# Altium project SD171-6.PrjPCB
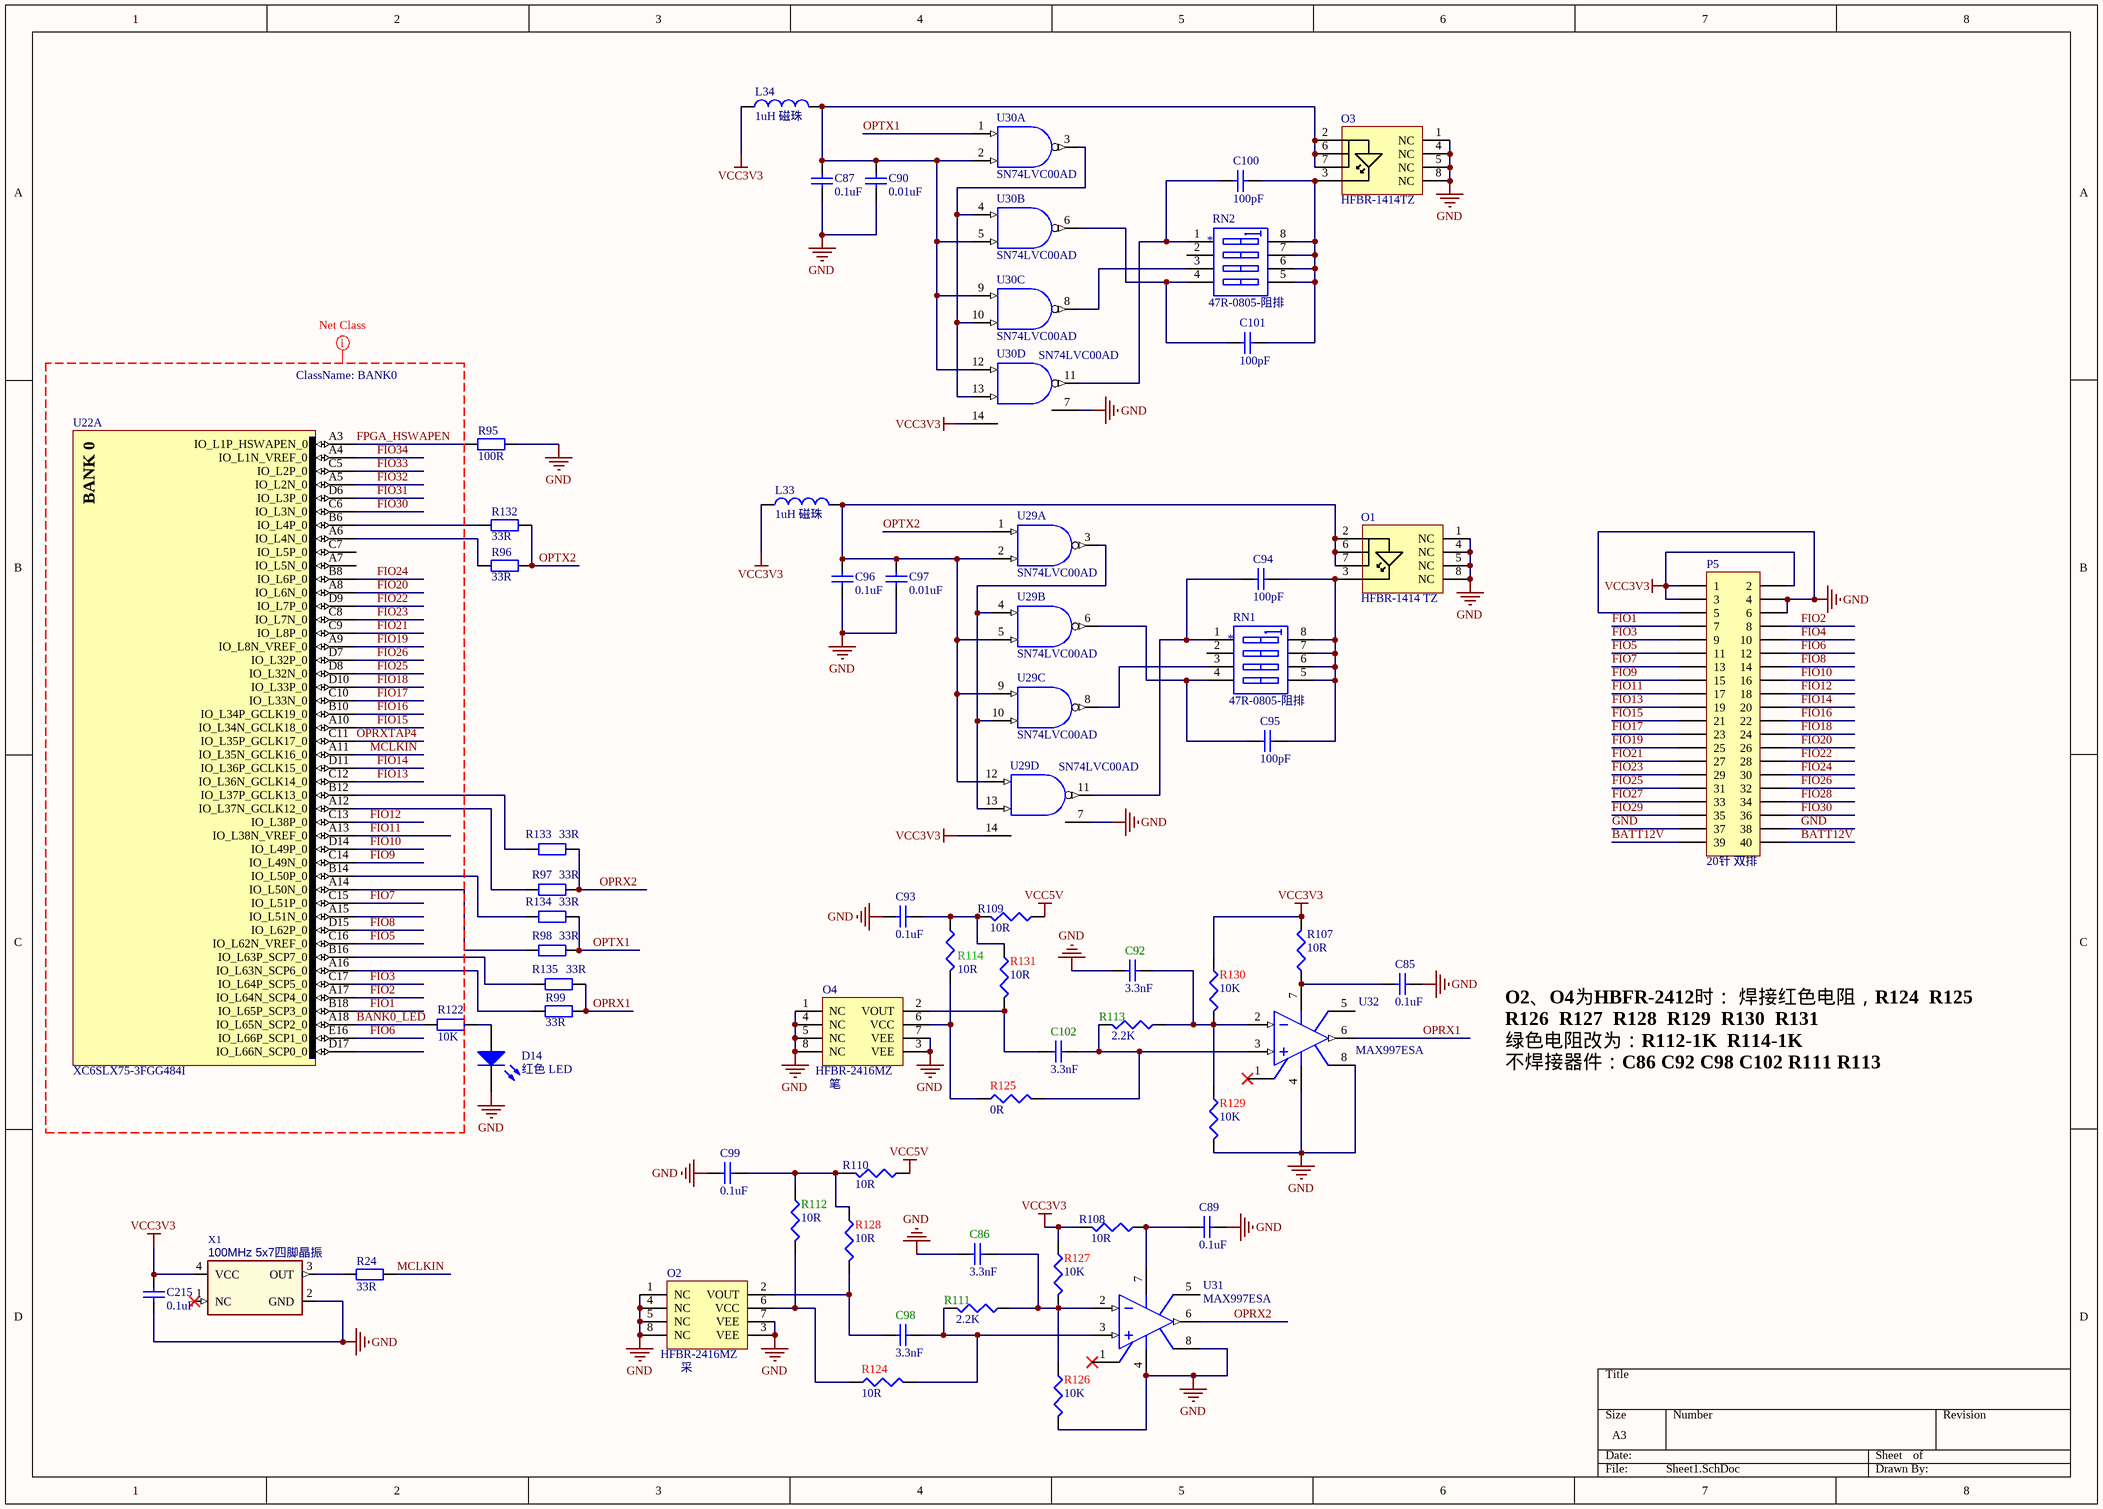
[diagram p0: Sheet1.SchDoc]
4 sheets, 276 parts. Net scope: global (net labels, ports and power ports of the same name join across sheets).
Board file: SD171-6.0PCB4.PcbDoc
Sheets:
  Sheet1.SchDoc
  Sheet3.SchDoc
  Sheet4.SchDoc
  Sheet5.SchDoc

## Sheet Sheet1.SchDoc
size A3

### Parts
C85  0.1uF  [0603C]
C86  3.3nF  [0603C]
C87  0.1uF  [0603C]
C89  0.1uF  [0603C]
C90  0.01uF  [0603C]
C92  3.3nF  [0603C]
C93  0.1uF  [0603C]
C94  100pF  [0603C]
C95  100pF  [0603C]
C96  0.1uF  [0603C]
C97  0.01uF  [0603C]
C98  3.3nF  [0603C]
C99  0.1uF  [0603C]
C100  100pF  [0603C]
C101  100pF  [0603C]
C102  3.3nF  [0603C]
C215  0.1uF  [0603C]
D14  红色 LED  [0805LED]
L33  1uH 磁珠  [1206L]
L34  1uH 磁珠  [1206L]
O1  HFBR-1414 TZ  [OPT]
O2  HFBR-2416MZ  [OPT]
O3  HFBR-1414TZ  [OPT]
O4  HFBR-2416MZ  [OPT]
P5  20针 双排  [HEAD2V40]
R24  33R  [0603R]
R95  100R  [0603R]
R96  33R  [0603R]
R97  33R  [0603R]
R98  33R  [0603R]
R99  33R  [0603R]
R107  10R  [0603R]
R108  10R  [0603R]
R109  10R  [0603R]
R110  10R  [0603R]
R111  2.2K  [0603R]
R112  10R  [0603R]
R113  2.2K  [0603R]
R114  10R  [0603R]
R122  10K  [0603R]
R124  10R  [0603R]
R125  0R  [0603R]
R126  10K  [0603R]
R127  10K  [0603R]
R128  10R  [0603R]
R129  10K  [0603R]
R130  10K  [0603R]
R131  10R  [0603R]
R132  33R  [0603R]
R133  33R  [0603R]
R134  33R  [0603R]
R135  33R  [0603R]
RN1  *  [RNS001]
RN2  *  [RNS001]
U22  XC6SLX75-3FGG484I  [FGG484]  (part A of 8)
U29  SN74LVC00AD  [SMD14X]  (parts A,B,C,D of 4)
U30  SN74LVC00AD  [SMD14X]  (parts A,B,C,D of 4)
U31  MAX997ESA  [SMD8XX]
U32  MAX997ESA  [SMD8XX]
X1  100MHz 5x7四脚晶振  [XTALSMD]

### Nets
BATT12V: P5.39 P5.40
GND: C85.2 C86.2 C87.2 C89.2 C90.1 C92.2 C93.2 C96.2 C97.1 C99.2 C215.2 D14.2(K) O1.1(NC) O1.4(NC) O1.5(NC) O1.8(NC) O2.1(NC) O2.3(VEE) O2.4(NC) O2.5(NC) O2.7(VEE) O2.8(NC) O3.1(NC) O3.4(NC) O3.5(NC) O3.8(NC) O4.1(NC) O4.3(VEE) O4.4(NC) O4.5(NC) O4.7(VEE) O4.8(NC) P5.4 P5.5 P5.6 P5.37 P5.38 R95.1 R126.2 R129.2 U29.7(GND) U30.7(GND) U31.4(V-) U31.8(EXT_CLKB) U32.4(V-) U32.8(EXT_CLKB) X1.2(GND)
VCC: U29.14(VCC) U30.14(VCC)
VCC3V3: C215.1 L33.1 L34.1 P5.1 P5.2 P5.3 R107.2 R108.2 R127.1 R130.1 U29.14(VCC) U30.14(VCC) X1.4(VCC)
VCC5V: R109.1 R110.1
BANK0_LED: R122.1 U22.A18(IO_L65N_SCP2_0)
FIO1: P5.7 U22.B18(IO_L65P_SCP3_0)
FIO2: P5.8 U22.A17(IO_L64N_SCP4_0)
FIO3: P5.9 U22.C17(IO_L64P_SCP5_0)
FIO4: P5.10
FIO5: P5.11 U22.C16(IO_L62N_VREF_0)
FIO6: P5.12 U22.E16(IO_L66P_SCP1_0)
FIO7: P5.13 U22.C15(IO_L51P_0)
FIO8: P5.14 U22.D15(IO_L62P_0)
FIO9: P5.15 U22.C14(IO_L49N_0)
FIO10: P5.16 U22.D14(IO_L49P_0)
FIO11: P5.17 U22.A13(IO_L38N_VREF_0)
FIO12: P5.18 U22.C13(IO_L38P_0)
FIO13: P5.19 U22.C12(IO_L36N_GCLK14_0)
FIO14: P5.20 U22.D11(IO_L36P_GCLK15_0)
FIO15: P5.21 U22.A10(IO_L34N_GCLK18_0)
FIO16: P5.22 U22.B10(IO_L34P_GCLK19_0)
FIO17: P5.23 U22.C10(IO_L33N_0)
FIO18: P5.24 U22.D10(IO_L33P_0)
FIO19: P5.25 U22.A9(IO_L8N_VREF_0)
FIO20: P5.26 U22.A8(IO_L6N_0)
FIO21: P5.27 U22.C9(IO_L8P_0)
FIO22: P5.28 U22.D9(IO_L7P_0)
FIO23: P5.29 U22.C8(IO_L7N_0)
FIO24: P5.30 U22.B8(IO_L6P_0)
FIO25: P5.31 U22.D8(IO_L32N_0)
FIO26: P5.32 U22.D7(IO_L32P_0)
FIO27: P5.33
FIO28: P5.34
FIO29: P5.35
FIO30: P5.36 U22.C6(IO_L3N_0)
FIO31: U22.D6(IO_L3P_0)
FIO32: U22.A5(IO_L2N_0)
FIO33: U22.C5(IO_L2P_0)
FIO34: U22.A4(IO_L1N_VREF_0)
FPGA_HSWAPEN: R95.2 U22.A3(IO_L1P_HSWAPEN_0)
MCLKIN: R24.2 U22.A11(IO_L35N_GCLK16_0)
OPRX1: R99.1 R135.1 U32.6(OUT)
OPRX2: R97.1 R133.1 U31.6(OUT)
OPRXTAP4: U22.C11(IO_L35P_GCLK17_0)
OPTX1: R98.1 R134.1 U30.1(A)
OPTX2: R96.1 R132.1 U29.1(A)
NetC85_1: C85.1 R107.1 U32.7(V+)
NetC86_1: C86.1 R111.1 R126.1 R127.2 U31.2(IN-)
NetC87_1: C87.1 C90.2 L34.2 O3.2 O3.6 O3.7 U30.2(B) U30.5(B) U30.9(A) U30.12(A)
NetC89_1: C89.1 R108.1 U31.7(V+)
NetC92_1: C92.1 R113.1 R129.1 R130.2 U32.2(IN-)
NetC93_1: C93.1 R109.2 R114.1 R131.1
NetC94_1: C94.1 C95.1 O1.3 RN1.5(B4) RN1.6(B3) RN1.7(B2) RN1.8(B1)
NetC94_2: C94.2 RN1.1(A1) U29.11(Y)
NetC95_2: C95.2 RN1.4(A4) U29.6(Y)
NetC96_1: C96.1 C97.2 L33.2 O1.2 O1.6 O1.7 U29.2(B) U29.5(B) U29.9(A) U29.12(A)
NetC98_1: C98.1 R111.2 R124.2 U31.3(IN+)
NetC98_2: C98.2 O2.2(VOUT) R128.2
NetC99_1: C99.1 R110.2 R112.1 R128.1
NetC100_1: C100.1 C101.1 O3.3 RN2.5(B4) RN2.6(B3) RN2.7(B2) RN2.8(B1)
NetC100_2: C100.2 RN2.1(A1) U30.11(Y)
NetC101_2: C101.2 RN2.4(A4) U30.6(Y)
NetC102_1: C102.1 R113.2 R125.2 U32.3(IN+)
NetC102_2: C102.2 O4.2(VOUT) R131.2
NetD14_1: D14.1(A) R122.2
NetO2_6: O2.6(VCC) R112.2 R124.1
NetO4_6: O4.6(VCC) R114.2 R125.1
NetR24_1: R24.1 X1.3(OUT)
NetR96_2: R96.2 U22.A6(IO_L4N_0)
NetR97_2: R97.2 U22.A12(IO_L37N_GCLK12_0)
NetR98_2: R98.2 U22.A14(IO_L50N_0)
NetR99_2: R99.2 U22.A16(IO_L63N_SCP6_0)
NetR132_2: R132.2 U22.B6(IO_L4P_0)
NetR133_2: R133.2 U22.B12(IO_L37P_GCLK13_0)
NetR134_2: R134.2 U22.B14(IO_L50P_0)
NetR135_2: R135.2 U22.B16(IO_L63P_SCP7_0)
NetRN1_3: RN1.3(A3) U29.8(Y)
NetRN2_3: RN2.3(A3) U30.8(Y)
NetU29_3: U29.3(Y) U29.4(A) U29.10(B) U29.13(B)
NetU30_3: U30.3(Y) U30.4(A) U30.10(B) U30.13(B)

Not connected (* = marked no-connect by the designer): RN1 2(A2); RN2 2(A2); U22 A7(IO_L5N_0) A15(IO_L51N_0) C7(IO_L5P_0) D17(IO_L66N_SCP0_0); U31 1(EXT_CLKA)* 5(RTN_CLK); U32 1(EXT_CLKA)* 5(RTN_CLK); X1 1(NC)*

### Layout directives
net class BANK0: BANK0_LED, FIO1, FIO2, FIO3, FIO5, FIO6, FIO7, FIO8, FIO9, FIO10, FIO11, FIO12, FIO13, FIO14, FIO15, FIO16, FIO17, FIO18, FIO19, FIO20, FIO21, FIO22, FIO23, FIO24, FIO25, FIO26, FIO30, FIO31, FIO32, FIO33, FIO34, FPGA_HSWAPEN, MCLKIN, OPRXTAP4

### Notes on the sheet
- (near O4) 笔
- O2、O4为HBFR-2412时： 焊接红色电阻，R124  R125  R126  R127  R128  R129  R130  R131
  绿色电阻改为：R112-1K  R114-1K
  不焊接器件：C86 C92 C98 C102 R111 R113
- (near O2) 采
- (in symbol SW DIP-4) 47R-0805-阻排
- (in symbol XC6SLX45-L1FGG484I, part A) BANK 0

### Library data of the parts
C85 C89 C215 = Cap: Capacitor; Published: 8-Jun-2000; LatestRevisionDate: 17-Jul-2002; LatestRevisionNote: Re-released for DXP Platform.; PackageReference: RAD-0.3; Publisher: Altium Limited; Value: 0.1uF
C86 C92 C93 C98 C99 C102 = Cap: Capacitor; Value: ?pF; Published: 8-Jun-2000; LatestRevisionDate: 17-Jul-2002; LatestRevisionNote: Re-released for DXP Platform.; PackageReference: RAD-0.3; Publisher: Altium Limited
C87 C90 C96 C97 = Cap Semi: Capacitor (Semiconductor SIM Model); Value: ?pF; Published: 8-Jun-2000; LatestRevisionDate: 29-May-2009; LatestRevisionNote: IPC-7351 Footprint Added.; PackageReference: C1206; Publisher: Altium Limited; PackageDescription: Chip Capacitor
C94 C95 C100 C101 = Cap Semi: Capacitor (Semiconductor SIM Model); Value: ?uF; Published: 8-Jun-2000; LatestRevisionDate: 29-May-2009; LatestRevisionNote: IPC-7351 Footprint Added.; PackageReference: C1206; Publisher: Altium Limited; PackageDescription: Chip Capacitor
D14 = LED0: Typical INFRARED GaAs LED; Published: 8-Jun-2000; LatestRevisionDate: 08-Jul-2005; LatestRevisionNote: Mech Layer 1 removed.; PackageReference: LED-0; Publisher: Altium Limited
L33 L34 = Inductor: Code_IEC: 1005; Published: 8-Jun-2000; LatestRevisionDate: 29-May-2009; LatestRevisionNote: IPC-7351 Footprint Added.; PackageReference: 0402-A; Publisher: Altium Limited; PackageDescription: Chip Inductor; Code_JEITA: 0402
O1 O3 = HFBR-1414
O2 O4 = OPTO
P5 = MHDR2X20: Header, 20-Pin, Dual row; LatestRevisionDate: 17-Jul-2002; LatestRevisionNote: Re-released for DXP Platform.; Publisher: Altium Limited
R24 R95-R99 R122 R132-R135 = Res2: Resistor; Published: 8-Jun-2000; LatestRevisionDate: 17-Jul-2002; LatestRevisionNote: Re-released for DXP Platform.; PackageReference: AXIAL-0.4; Publisher: Altium Limited
  R24 R96-R99 R132-R135: Value: 33R
  R95: Value: 100R
  R122: Value: 10K
R107-R114 R124 R128 R131 = Res3: Resistor; Published: 8-Jun-2000; LatestRevisionDate: 29-May-2009; LatestRevisionNote: IPC-7351 Footprint Added.; PackageReference: J1-0603; Publisher: Altium Limited; PackageDescription: Chip Resistor
  R107-R110 R112 R114 R124 R128 R131: Value: 10R
  R111 R113: Value: 2.2K
R125-R127 R129 R130 = Res3: Resistor; Value: 10R; Published: 8-Jun-2000; LatestRevisionDate: 29-May-2009; LatestRevisionNote: IPC-7351 Footprint Added.; PackageReference: J1-0603; Publisher: Altium Limited; PackageDescription: Chip Resistor
RN1 RN2 = SW DIP-4: DIP Switch, 4 Position, SPST; Published: 24-Mar-1999; LatestRevisionDate: 29-May-2009; LatestRevisionNote: IPC-7351 Footprint Added.; PackageVersion: Dec-2002; PackageReference: SO8; Publisher: Altium Limited; PackageDescription: 8-Pin Small Outline Integrated Circuit 1.27 mm Pitch; Code_JEDEC: MS-012-AA; Code_IPC: SOIC127P600-8
U22 = XC6SLX45-L1FGG484I: Spartan-6 LX 1.0V FPGA, 316 User I/Os, 484-Ball Fine-Pitch BGA (1.0mm Pitch), Low Power Version, Industrial Grade, Pb-Free; FirstPublished: 17-Nov-2009; DatasheetVersion: ver1.3, Nov-2009; PackageVersion: ver1.1, Dec-2008; PackageReference: FGG484; Publisher: Altium Limited; PackageDescription: 484-Ball Fine Pitch Ball Grid Array 1.00 mm Pitch (FGG484) - Pb-Free; Code_JEDEC: MS-034-AAJ-1; Code_IPC: BGA100P22X22-484; ComponentLink1Description: Spartan-6 Datasheet; ComponentLink1URL: http://www.xilinx.com/support/documentation/data_sheets/ds160.pdf; ComponentLink2Description: Pinout Specification; ComponentLink2URL: http://www.xilinx.com/support/documentation/user_guides/ug385.pdf; ComponentLink3Description: FGG484 Package Drawing; ComponentLink3URL: http://www.xilinx.com/support/documentation/package_specs/fg484.pdf; ComponentLink4Description: Spartan-6 Documents; ComponentLink4URL: http://www.xilinx.com/support/documentation/spartan-6.htm; ComponentLink5Description: Xilinx.com Home; ComponentLink5URL: http://www.xilinx.com
U29 U30 = SN74LVC00AD: Quadruple 2-Input Positive-NAND Gate; Published: 8-Jun-2000; LatestRevisionDate: 13-Apr-2006; LatestRevisionNote: IPC-7351 Footprint Added.; DatasheetVersion: Jun-1998; PackageVersion: Jan-1998; PackageReference: D014; Publisher: Altium Limited; PackageDescription: 14-Pin Small Outline Integrated Circuit 1.27 mm Pitch; Code_IPC: SOIC127P600-14; ComponentLink1Description: Manufacturer Link; ComponentLink1URL: http://www.ti.com/; ComponentLink2Description: Datasheet; ComponentLink2URL: http://www-s.ti.com/sc/ds/SN54LVC00A.pdf
U31 U32 = ICL7650BCSA-1: Chopper Stabilized Operational Amplifier; Published: 16-Jan-2001; LatestRevisionDate: 13-Apr-2006; LatestRevisionNote: IPC-7351 Footprint Added.; DatasheetVersion: Aug-1996; PackageReference: NSO8; Publisher: Altium Limited; PackageDescription: 8-Pin Small Outline Integrated Circuit 1.27 mm Pitch; Code_JEDEC: MS-012-AA; Code_IPC: SOIC127P600-8; ComponentLink1Description: Manufacturer Link; ComponentLink1URL: http://www.maxim-ic.com/; ComponentLink2Description: Datasheet; ComponentLink2URL: http://pdfserv.maxim-ic.com/en/ds/ICL7650-ICL7650B.pdf
X1 = TCXO 20MHz Rakon E5249LF 5x3.2: TCXO, 20MHz, 100ppb, 5x3.2mm SMT, clipped sine o/p; Alternative Parts/Notes: E5074LF; Manufacturer: Rakon; ALS Lib: L3078B; Tolerance: 50ppm; Notes: aka  E5074LF (Ubiquisys-specific part no); CLASS: IC; Volts: 3.3V; Full Part No: E5249LF; Case: 5 x 3.2mm

## Sheet Sheet3.SchDoc
size A3
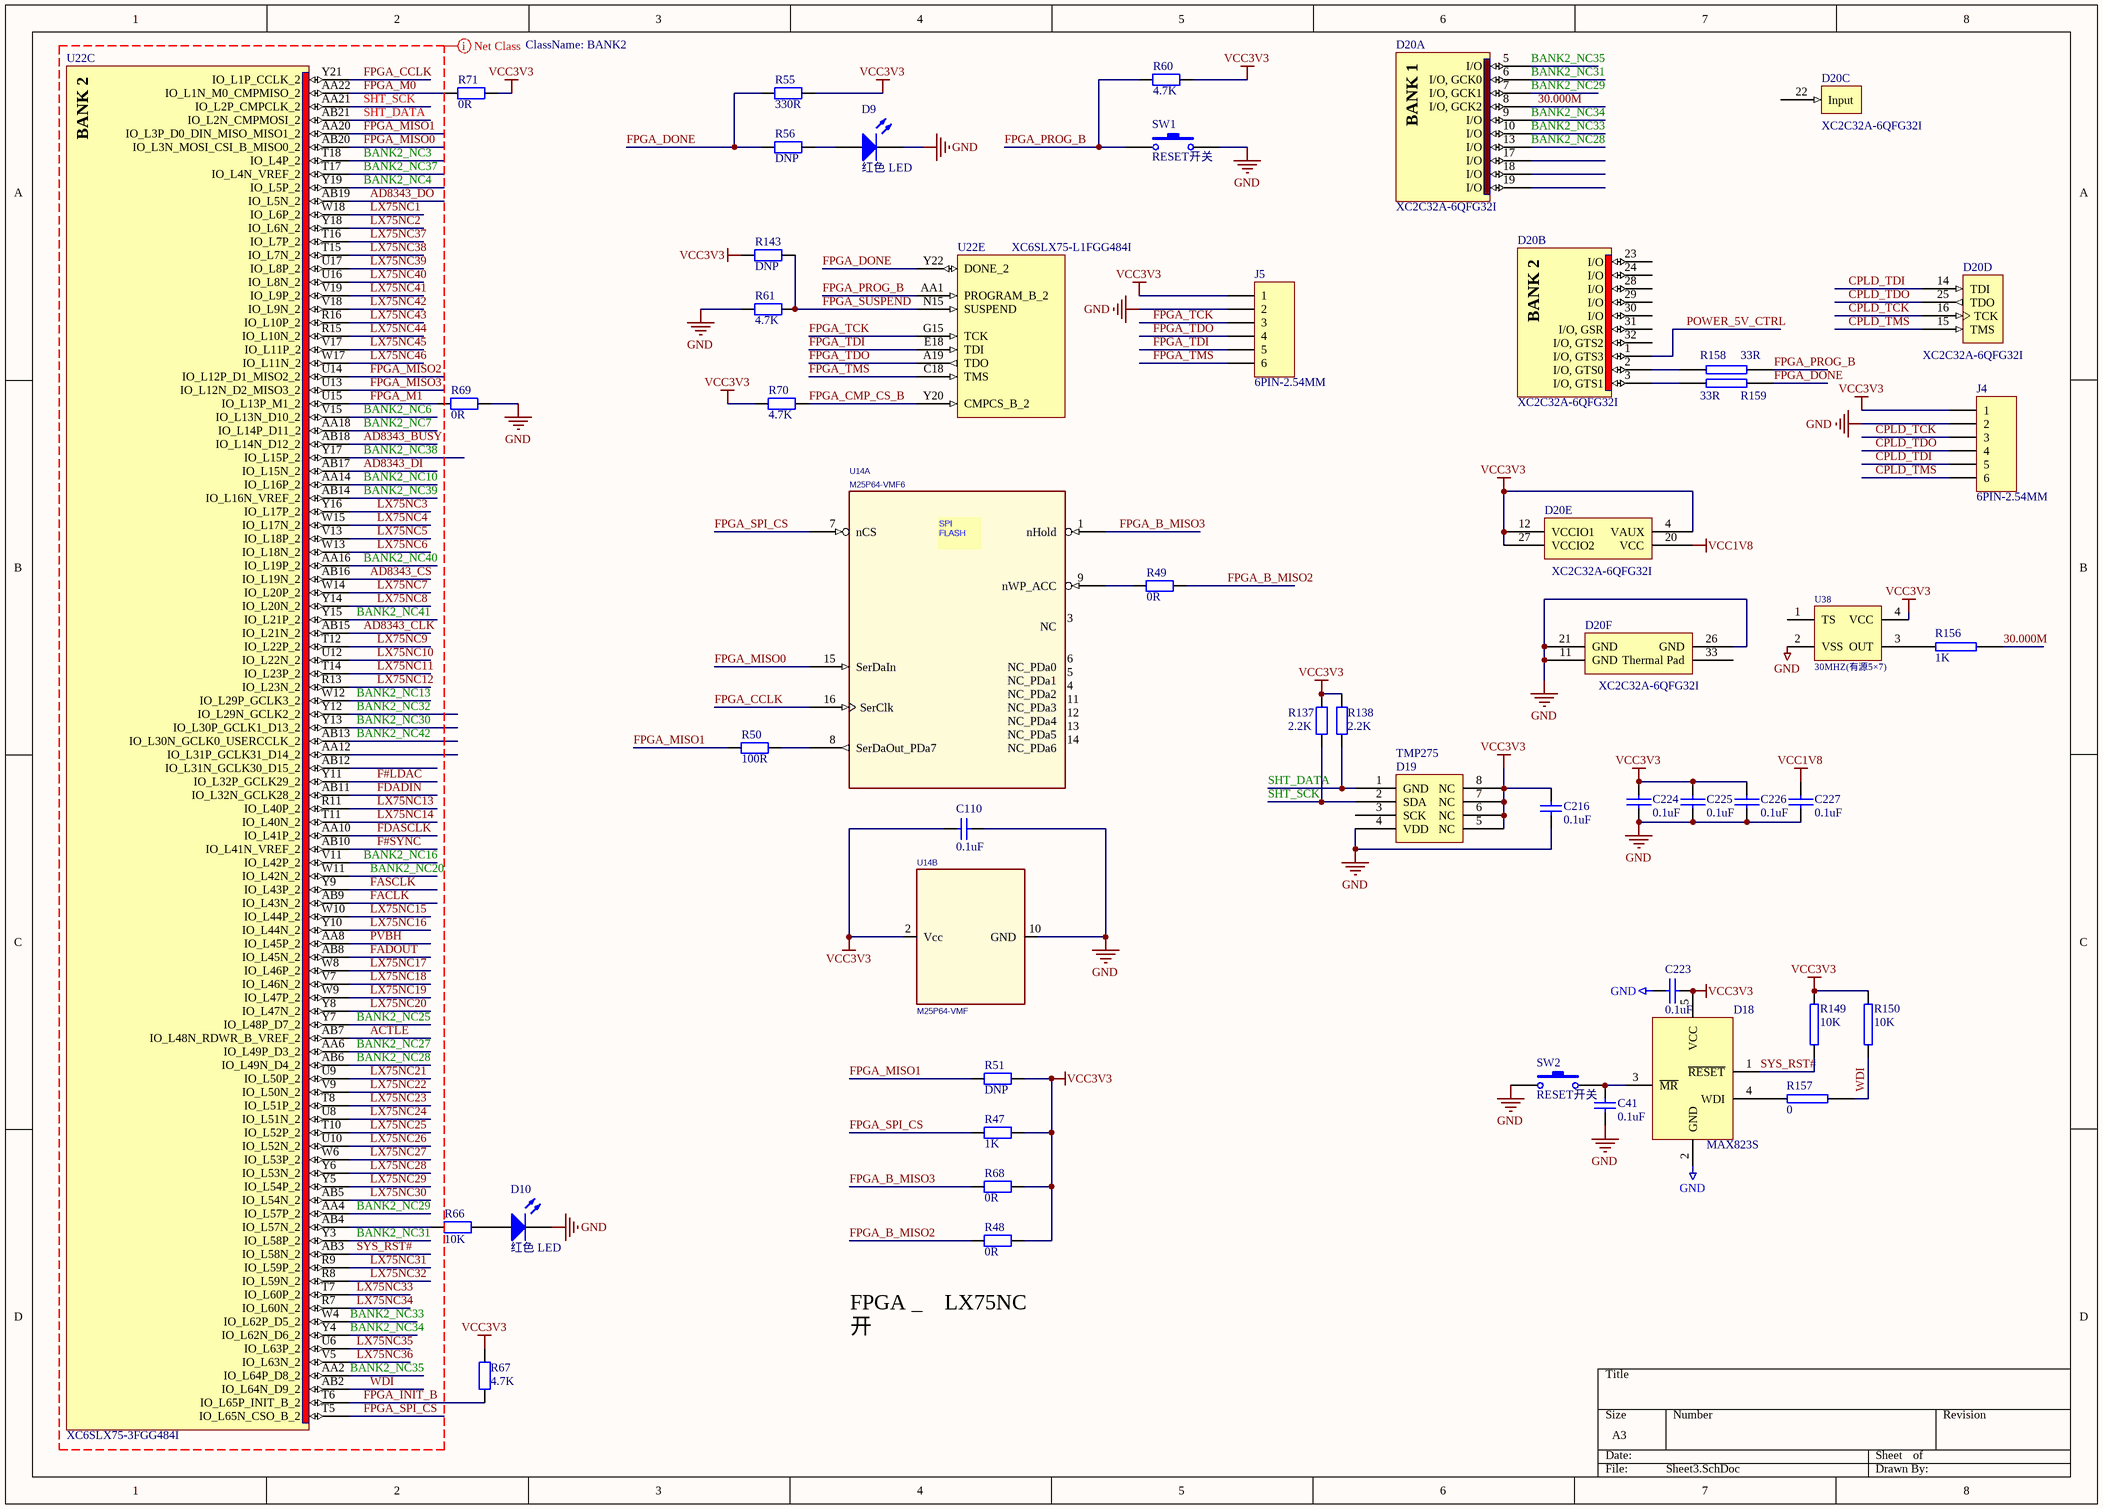
[diagram p1: Sheet3.SchDoc]

### Parts
C41  0.1uF  [0603C]
C110  0.1uF  [0402C]
C216  0.1uF  [0402C]
C223  0.1uF  [0603X]
C224  0.1uF  [0402C]
C225  0.1uF  [0402C]
C226  0.1uF  [0402C]
C227  0.1uF  [0402C]
D9  红色 LED  [0805LED]
D10  红色 LED  [0805LED]
D18  MAX823S  [MAX823]
D19  TMP275  [SMD8XX]
D20  XC2C32A-6QFG32I  [QFG32_N]  (parts A,B,C,D,E,F of 6)
J4  6PIN-2.54MM  [SIP6X]
J5  6PIN-2.54MM  [SIP6X]
R47  1K  [0603R]
R48  0R  [0603R]
R49  0R  [0603R]
R50  100R  [0603R]
R51  DNP  [0603R]
R55  330R  [0603R]
R56  DNP  [0603R]
R60  4.7K  [0603R]
R61  4.7K  [0603R]
R66  10K  [0603R]
R67  4.7K  [0603R]
R68  0R  [0603R]
R69  0R  [0603R]
R70  4.7K  [0603R]
R71  0R  [0603R]
R137  2.2K  [0603R]
R138  2.2K  [0603R]
R143  DNP  [0603R]
R149  10K  [0603X]
R150  10K  [0603X]
R156  1K  [0603]
R157  0  [0603]
R158  33R  [0603R]
R159  33R  [0603R]
SW1  RESET开关  [RESETKEY]
SW2  RESET开关  [RESETKEY]
U14  M25P64-VMF6  [SOIC16]  (parts A,B of 2)
U22  XC6SLX75-3FGG484I  [FGG484]  (parts C,E of 8)
U38  30MHZ(有源5×7)  [30M]

### Nets
GND: C41.1 C110.1 C216.1 C223.1 C224.1 C225.1 C226.1 C227.1 D9.2(K) D10.2(K) D18.2(GND) D19.4(VDD) D20.11(GND) D20.21(GND) D20.26(GND) J4.2 J5.2 R61.1 R69.1 SW1.2 SW2.1 U14.10(GND) U38.2(VSS)
VCC1V8: C227.2 D20.20(VCC)
VCC3V3: C110.2 C216.2 C223.2 C224.2 C225.2 C226.2 D18.5(VCC) D19.5(NC) D19.6(NC) D19.7(NC) D19.8(NC) D20.4(VAUX) D20.12(VCCIO1) D20.27(VCCIO2) J4.1 J5.1 R47.2 R48.2 R51.2 R55.2 R60.2 R67.1 R68.2 R70.1 R71.1 R137.1 R138.1 R143.1 R149.2 R150.2 U14.2(Vcc) U38.4(VCC)
30.000M: D20.8(I/O,_GCK2) R156.2
ACTLE: U22.AB7(IO_L48N_RDWR_B_VREF_2)
AD8343_BUSY: U22.AB18(IO_L14N_D12_2)
AD8343_CLK: U22.AB15(IO_L21N_2)
AD8343_CS: U22.AB16(IO_L19N_2)
AD8343_DI: U22.AB17(IO_L15N_2)
AD8343_DO: U22.AB19(IO_L5N_2)
BANK2_NC3: U22.T18(IO_L4P_2)
BANK2_NC4: U22.Y19(IO_L5P_2)
BANK2_NC6: U22.V15(IO_L13N_D10_2)
BANK2_NC7: U22.AA18(IO_L14P_D11_2)
BANK2_NC10: U22.AA14(IO_L16P_2)
BANK2_NC13: U22.W12(IO_L29P_GCLK3_2)
BANK2_NC16: U22.V11(IO_L42P_2)
BANK2_NC20: U22.W11(IO_L42N_2)
BANK2_NC25: U22.Y7(IO_L48P_D7_2)
BANK2_NC27: U22.AA6(IO_L49P_D3_2)
BANK2_NC28: D20.13(I/O) U22.AB6(IO_L49N_D4_2)
BANK2_NC29: D20.7(I/O,_GCK1) U22.AA4(IO_L57P_2)
BANK2_NC30: U22.Y13(IO_L30P_GCLK1_D13_2)
BANK2_NC31: D20.6(I/O,_GCK0) U22.Y3(IO_L58P_2)
BANK2_NC32: U22.Y12(IO_L29N_GCLK2_2)
BANK2_NC33: D20.10(I/O) U22.W4(IO_L62P_D5_2)
BANK2_NC34: D20.9(I/O) U22.Y4(IO_L62N_D6_2)
BANK2_NC35: D20.5(I/O) U22.AA2(IO_L64P_D8_2)
BANK2_NC37: U22.T17(IO_L4N_VREF_2)
BANK2_NC38: U22.Y17(IO_L15P_2)
BANK2_NC39: U22.AB14(IO_L16N_VREF_2)
BANK2_NC40: U22.AA16(IO_L19P_2)
BANK2_NC41: U22.Y15(IO_L21P_2)
BANK2_NC42: U22.AB13(IO_L30N_GCLK0_USERCCLK_2)
CPLD_TCK: D20.16(TCK) J4.3
CPLD_TDI: D20.14(TDI) J4.5
CPLD_TDO: D20.25(TDO) J4.4
CPLD_TMS: D20.15(TMS) J4.6
F#LDAC: U22.Y11(IO_L32P_GCLK29_2)
F#SYNC: U22.AB10(IO_L41N_VREF_2)
FACLK: U22.AB9(IO_L43N_2)
FADOUT: U22.AB8(IO_L45N_2)
FASCLK: U22.Y9(IO_L43P_2)
FDADIN: U22.AB11(IO_L32N_GCLK28_2)
FDASCLK: U22.AA10(IO_L41P_2)
FPGA_B_MISO2: R48.1 R49.2
FPGA_B_MISO3: R68.1 U14.1(nHold)
FPGA_CCLK: U14.16(SerClk) U22.Y21(IO_L1P_CCLK_2)
FPGA_CMP_CS_B: R70.2 U22.Y20(CMPCS_B_2)
FPGA_DONE: R55.1 R56.1 R159.2 U22.Y22(DONE_2)
FPGA_INIT_B: R67.2 U22.T6(IO_L65P_INIT_B_2)
FPGA_M0: R71.2 U22.AA22(IO_L1N_M0_CMPMISO_2)
FPGA_M1: R69.2 U22.U15(IO_L13P_M1_2)
FPGA_MISO0: U14.15(SerDaIn) U22.AB20(IO_L3N_MOSI_CSI_B_MISO0_2)
FPGA_MISO1: R50.1 R51.1 U22.AA20(IO_L3P_D0_DIN_MISO_MISO1_2)
FPGA_MISO2: U22.U14(IO_L12P_D1_MISO2_2)
FPGA_MISO3: U22.U13(IO_L12N_D2_MISO3_2)
FPGA_PROG_B: R60.1 R158.2 SW1.1 U22.AA1(PROGRAM_B_2)
FPGA_SPI_CS: R47.1 U14.7(nCS) U22.T5(IO_L65N_CSO_B_2)
FPGA_SUSPEND: R61.2 R143.2 U22.N15(SUSPEND)
FPGA_TCK: J5.3 U22.G15(TCK)
FPGA_TDI: J5.5 U22.E18(TDI)
FPGA_TDO: J5.4 U22.A19(TDO)
FPGA_TMS: J5.6 U22.C18(TMS)
LX75NC1: U22.W18(IO_L6P_2)
LX75NC2: U22.Y18(IO_L6N_2)
LX75NC3: U22.Y16(IO_L17P_2)
LX75NC4: U22.W15(IO_L17N_2)
LX75NC5: U22.V13(IO_L18P_2)
LX75NC6: U22.W13(IO_L18N_2)
LX75NC7: U22.W14(IO_L20P_2)
LX75NC8: U22.Y14(IO_L20N_2)
LX75NC9: U22.T12(IO_L22P_2)
LX75NC10: U22.U12(IO_L22N_2)
LX75NC11: U22.T14(IO_L23P_2)
LX75NC12: U22.R13(IO_L23N_2)
LX75NC13: U22.R11(IO_L40P_2)
LX75NC14: U22.T11(IO_L40N_2)
LX75NC15: U22.W10(IO_L44P_2)
LX75NC16: U22.Y10(IO_L44N_2)
LX75NC17: U22.W8(IO_L46P_2)
LX75NC18: U22.V7(IO_L46N_2)
LX75NC19: U22.W9(IO_L47P_2)
LX75NC20: U22.Y8(IO_L47N_2)
LX75NC21: U22.U9(IO_L50P_2)
LX75NC22: U22.V9(IO_L50N_2)
LX75NC23: U22.T8(IO_L51P_2)
LX75NC24: U22.U8(IO_L51N_2)
LX75NC25: U22.T10(IO_L52P_2)
LX75NC26: U22.U10(IO_L52N_2)
LX75NC27: U22.W6(IO_L53P_2)
LX75NC28: U22.Y6(IO_L53N_2)
LX75NC29: U22.Y5(IO_L54P_2)
LX75NC30: U22.AB5(IO_L54N_2)
LX75NC31: U22.R9(IO_L59P_2)
LX75NC32: U22.R8(IO_L59N_2)
LX75NC33: U22.T7(IO_L60P_2)
LX75NC34: U22.R7(IO_L60N_2)
LX75NC35: U22.U6(IO_L63P_2)
LX75NC36: U22.V5(IO_L63N_2)
LX75NC37: U22.T16(IO_L7P_2)
LX75NC38: U22.T15(IO_L7N_2)
LX75NC39: U22.U17(IO_L8P_2)
LX75NC40: U22.U16(IO_L8N_2)
LX75NC41: U22.V19(IO_L9P_2)
LX75NC42: U22.V18(IO_L9N_2)
LX75NC43: U22.R16(IO_L10P_2)
LX75NC44: U22.R15(IO_L10N_2)
LX75NC45: U22.V17(IO_L11P_2)
LX75NC46: U22.W17(IO_L11N_2)
POWER_5V_CTRL: D20.1(I/O,_GTS3)
PVBH: U22.AA8(IO_L45P_2)
SHT_DATA: D19.1(GND) R138.2 U22.AB21(IO_L2N_CMPMOSI_2)
SHT_SCK: D19.2(SDA) R137.2 U22.AA21(IO_L2P_CMPCLK_2)
SYS_RST#: D18.1(~{RESET}) R149.1 U22.AB3(IO_L58N_2)
WDI: R150.1 R157.2 U22.AB2(IO_L64N_D9_2)
NetC41_2: C41.2 D18.3(~{MR}) SW2.2
NetD9_1: D9.1(A) R56.2
NetD10_1: D10.1(A) R66.2
NetD18_4: D18.4(WDI) R157.1
NetD20_2: D20.2(I/O,_GTS0) R158.1
NetD20_3: D20.3(I/O,_GTS1) R159.1
NetR49_1: R49.1 U14.9(nWP_ACC)
NetR50_2: R50.2 U14.8(SerDaOut_PDa7)
NetR66_1: R66.1 U22.AB4(IO_L57N_2)
NetR156_1: R156.1 U38.3(OUT)

Not connected (* = marked no-connect by the designer): D19 3(SCK); D20 17(I/O) 18(I/O) 19(I/O) 22(Input) 23(I/O) 24(I/O) 28(I/O) 29(I/O) 30(I/O) 31(I/O,_GSR) 32(I/O,_GTS2) 33(Thermal_Pad); U14 3(NC) 4(NC_PDa2) 5(NC_PDa1) 6(NC_PDa0) 11(NC_PDa3) 12(NC_PDa4) 13(NC_PDa5) 14(NC_PDa6); U22 AA12(IO_L31P_GCLK31_D14_2) AB12(IO_L31N_GCLK30_D15_2); U38 1(TS)

### Layout directives
net class BANK2: ACTLE, AD8343_BUSY, AD8343_CLK, AD8343_CS, AD8343_DI, AD8343_DO, BANK2_NC3, BANK2_NC4, BANK2_NC6, BANK2_NC7, BANK2_NC10, BANK2_NC13, BANK2_NC16, BANK2_NC20, BANK2_NC25, BANK2_NC27, BANK2_NC28, BANK2_NC29, BANK2_NC30, BANK2_NC31, BANK2_NC32, BANK2_NC33, BANK2_NC34, BANK2_NC35, BANK2_NC37, BANK2_NC38, BANK2_NC39, BANK2_NC40, BANK2_NC41, BANK2_NC42, F#LDAC, F#SYNC, FACLK, FADOUT, FASCLK, FDADIN, FDASCLK, FPGA_CCLK, FPGA_INIT_B, FPGA_M0, FPGA_M1, FPGA_MISO0, FPGA_MISO1, FPGA_MISO2, FPGA_MISO3, FPGA_SPI_CS, LX75NC1, LX75NC2, LX75NC3, LX75NC4, LX75NC5, LX75NC6, LX75NC7, LX75NC8, LX75NC9, LX75NC10, LX75NC11, LX75NC12, LX75NC13, LX75NC14, LX75NC15, LX75NC16, LX75NC17, LX75NC18, LX75NC19, LX75NC20, LX75NC21, LX75NC22, LX75NC23, LX75NC24, LX75NC25, LX75NC26, LX75NC27, LX75NC28, LX75NC29, LX75NC30, LX75NC31, LX75NC32, LX75NC33, LX75NC34, LX75NC35, LX75NC36, LX75NC37, LX75NC38, LX75NC39, LX75NC40, LX75NC41, LX75NC42, LX75NC43, LX75NC44, LX75NC45, LX75NC46, PVBH, SHT_DATA, SHT_SCK, SYS_RST#, WDI

### Notes on the sheet
- (near R48) FPGA _    LX75NC 开
- (in symbol SPI FLASH 128Mb S25FL128P, part A) SPI / FLASH
- (in symbol XC2C32A-6QFG32C, part A) BANK 1
- (in symbol XC2C32A-6QFG32C, part B) BANK 2
- (in symbol XC6SLX45-L1FGG484I, part C) BANK 2

### Library data of the parts
C41 C110 C216 = Cap: Capacitor; Published: 8-Jun-2000; LatestRevisionDate: 17-Jul-2002; LatestRevisionNote: Re-released for DXP Platform.; PackageReference: RAD-0.3; Publisher: Altium Limited; Value: 0.1uF
C223-C227 = 2543.S01_104_49
D9 = LED2: Typical RED, GREEN, YELLOW, AMBER GaAs LED; Published: 8-Jun-2000; LatestRevisionDate: 17-Jul-2002; LatestRevisionNote: Re-released for DXP Platform.; PackageVersion: Feb-2002; PackageReference: 3.2X1.6X1.1; Publisher: Altium Limited
D10 = LED0: Typical INFRARED GaAs LED; Published: 8-Jun-2000; LatestRevisionDate: 08-Jul-2005; LatestRevisionNote: Mech Layer 1 removed.; PackageReference: LED-0; Publisher: Altium Limited
D18 = MAX823: MAX823复位监控芯片
D19 = SHT11
D20 = XC2C32A-6QFG32C: CoolRunner-II 1.8V, 32 Macrocell CPLD, 21 User I/Os, 32-Pin QFNL, Commercial Grade, Pb-Free; FirstPublished: 8-Jul-2005; LatestRevisionDate: 30-Oct-2009; LatestRevisionNote: Updated to datasheet version 3.1 Sep-2008.; DatasheetVersion: ver2.1, Nov-2008; PackageVersion: ver1.0, Aug-2004; PackageReference: QFG32; Publisher: Altium Limited; PackageDescription: 32-Pin Quad Flat No-Lead (QFG32) - Pb-Free; Supplier 1: Digi-Key; Supplier Part Number 1: 122-1412-ND; Code_JEDEC: MO-220; ComponentLink1Description: XC2C32A Datasheet; ComponentLink1URL: http://www.xilinx.com/support/documentation/data_sheets/ds310.pdf; ComponentLink2Description: QFG32 Package Drawing; ComponentLink2URL: http://www.xilinx.com/support/documentation/package_specs/qfg32.pdf; ComponentLink3Description: CoolRunner-II Documents; ComponentLink3URL: http://www.xilinx.com/support/documentation/coolrunner-ii.htm; ComponentLink4Description: Xilinx.com Home; ComponentLink4URL: http://www.xilinx.com
J4 J5 = Header 6: Header, 6-Pin; LatestRevisionDate: 17-Jul-2002; LatestRevisionNote: Re-released for DXP Platform.; Publisher: Altium Limited
R47 R50 R51 R60 R61 R66 R67 R69 R70 = Res2: Resistor; Published: 8-Jun-2000; LatestRevisionDate: 17-Jul-2002; LatestRevisionNote: Re-released for DXP Platform.; PackageReference: AXIAL-0.4; Publisher: Altium Limited
  R47: Value: 1K
  R50: Value: 100R
  R51: Value: DNP
  R60 R61 R67 R70: Value: 4.7K
  R66: Value: 10K
  R69: Value: 0R
R48 R68 = Res2: Resistor; Value: 1.8K; Published: 8-Jun-2000; LatestRevisionDate: 17-Jul-2002; LatestRevisionNote: Re-released for DXP Platform.; PackageReference: AXIAL-0.4; Publisher: Altium Limited
R49 R137 R138 = Res2: Resistor; Value: 100R; Published: 8-Jun-2000; LatestRevisionDate: 17-Jul-2002; LatestRevisionNote: Re-released for DXP Platform.; PackageReference: AXIAL-0.4; Publisher: Altium Limited
R55 R143 = Res2: Resistor; Value: 4.7K; Published: 8-Jun-2000; LatestRevisionDate: 17-Jul-2002; LatestRevisionNote: Re-released for DXP Platform.; PackageReference: AXIAL-0.4; Publisher: Altium Limited
R56 = Res2: Resistor; Value: 510; Published: 8-Jun-2000; LatestRevisionDate: 17-Jul-2002; LatestRevisionNote: Re-released for DXP Platform.; PackageReference: AXIAL-0.4; Publisher: Altium Limited
R71 = Res2: Resistor; Value: 4K7; Published: 8-Jun-2000; LatestRevisionDate: 17-Jul-2002; LatestRevisionNote: Re-released for DXP Platform.; PackageReference: AXIAL-0.4; Publisher: Altium Limited
R149 R150 = RES2: 电阻
R156-R159 = RES2
SW1 SW2 = SW-PB: Switch; Published: 24-Mar-1999; LatestRevisionDate: 17-Jul-2002; LatestRevisionNote: Re-released for DXP Platform.; PackageReference: SPST-2; Publisher: Altium Limited
U14 = SPI FLASH 128Mb S25FL128P: SPI FLASH 128Mbit, 104MHz, 64kB sector; Full Part No: S25FL128P0XMFI00; Manufacturer: Spansion; Volts: 3.3V; ALS Lib: L0505; CLASS: IC; Type: SPI; Case: SOIC16
U22 = XC6SLX45-L1FGG484I: as U22 on sheet Sheet1; FirstPublished: 17-Nov-2009; DatasheetVersion: ver1.3, Nov-2009; PackageVersion: ver1.1, Dec-2008; PackageReference: FGG484; Publisher: Altium Limited; PackageDescription: 484-Ball Fine Pitch Ball Grid Array 1.00 mm Pitch (FGG484) - Pb-Free; Code_JEDEC: MS-034-AAJ-1; Code_IPC: BGA100P22X22-484; ComponentLink1Description: Spartan-6 Datasheet; ComponentLink1URL: http://www.xilinx.com/support/documentation/data_sheets/ds160.pdf; ComponentLink2Description: Pinout Specification; ComponentLink2URL: http://www.xilinx.com/support/documentation/user_guides/ug385.pdf; ComponentLink3Description: FGG484 Package Drawing; ComponentLink3URL: http://www.xilinx.com/support/documentation/package_specs/fg484.pdf; ComponentLink4Description: Spartan-6 Documents; ComponentLink4URL: http://www.xilinx.com/support/documentation/spartan-6.htm; ComponentLink5Description: Xilinx.com Home; ComponentLink5URL: http://www.xilinx.com
U38 = CRYSTAL

## Sheet Sheet4.SchDoc
size A3
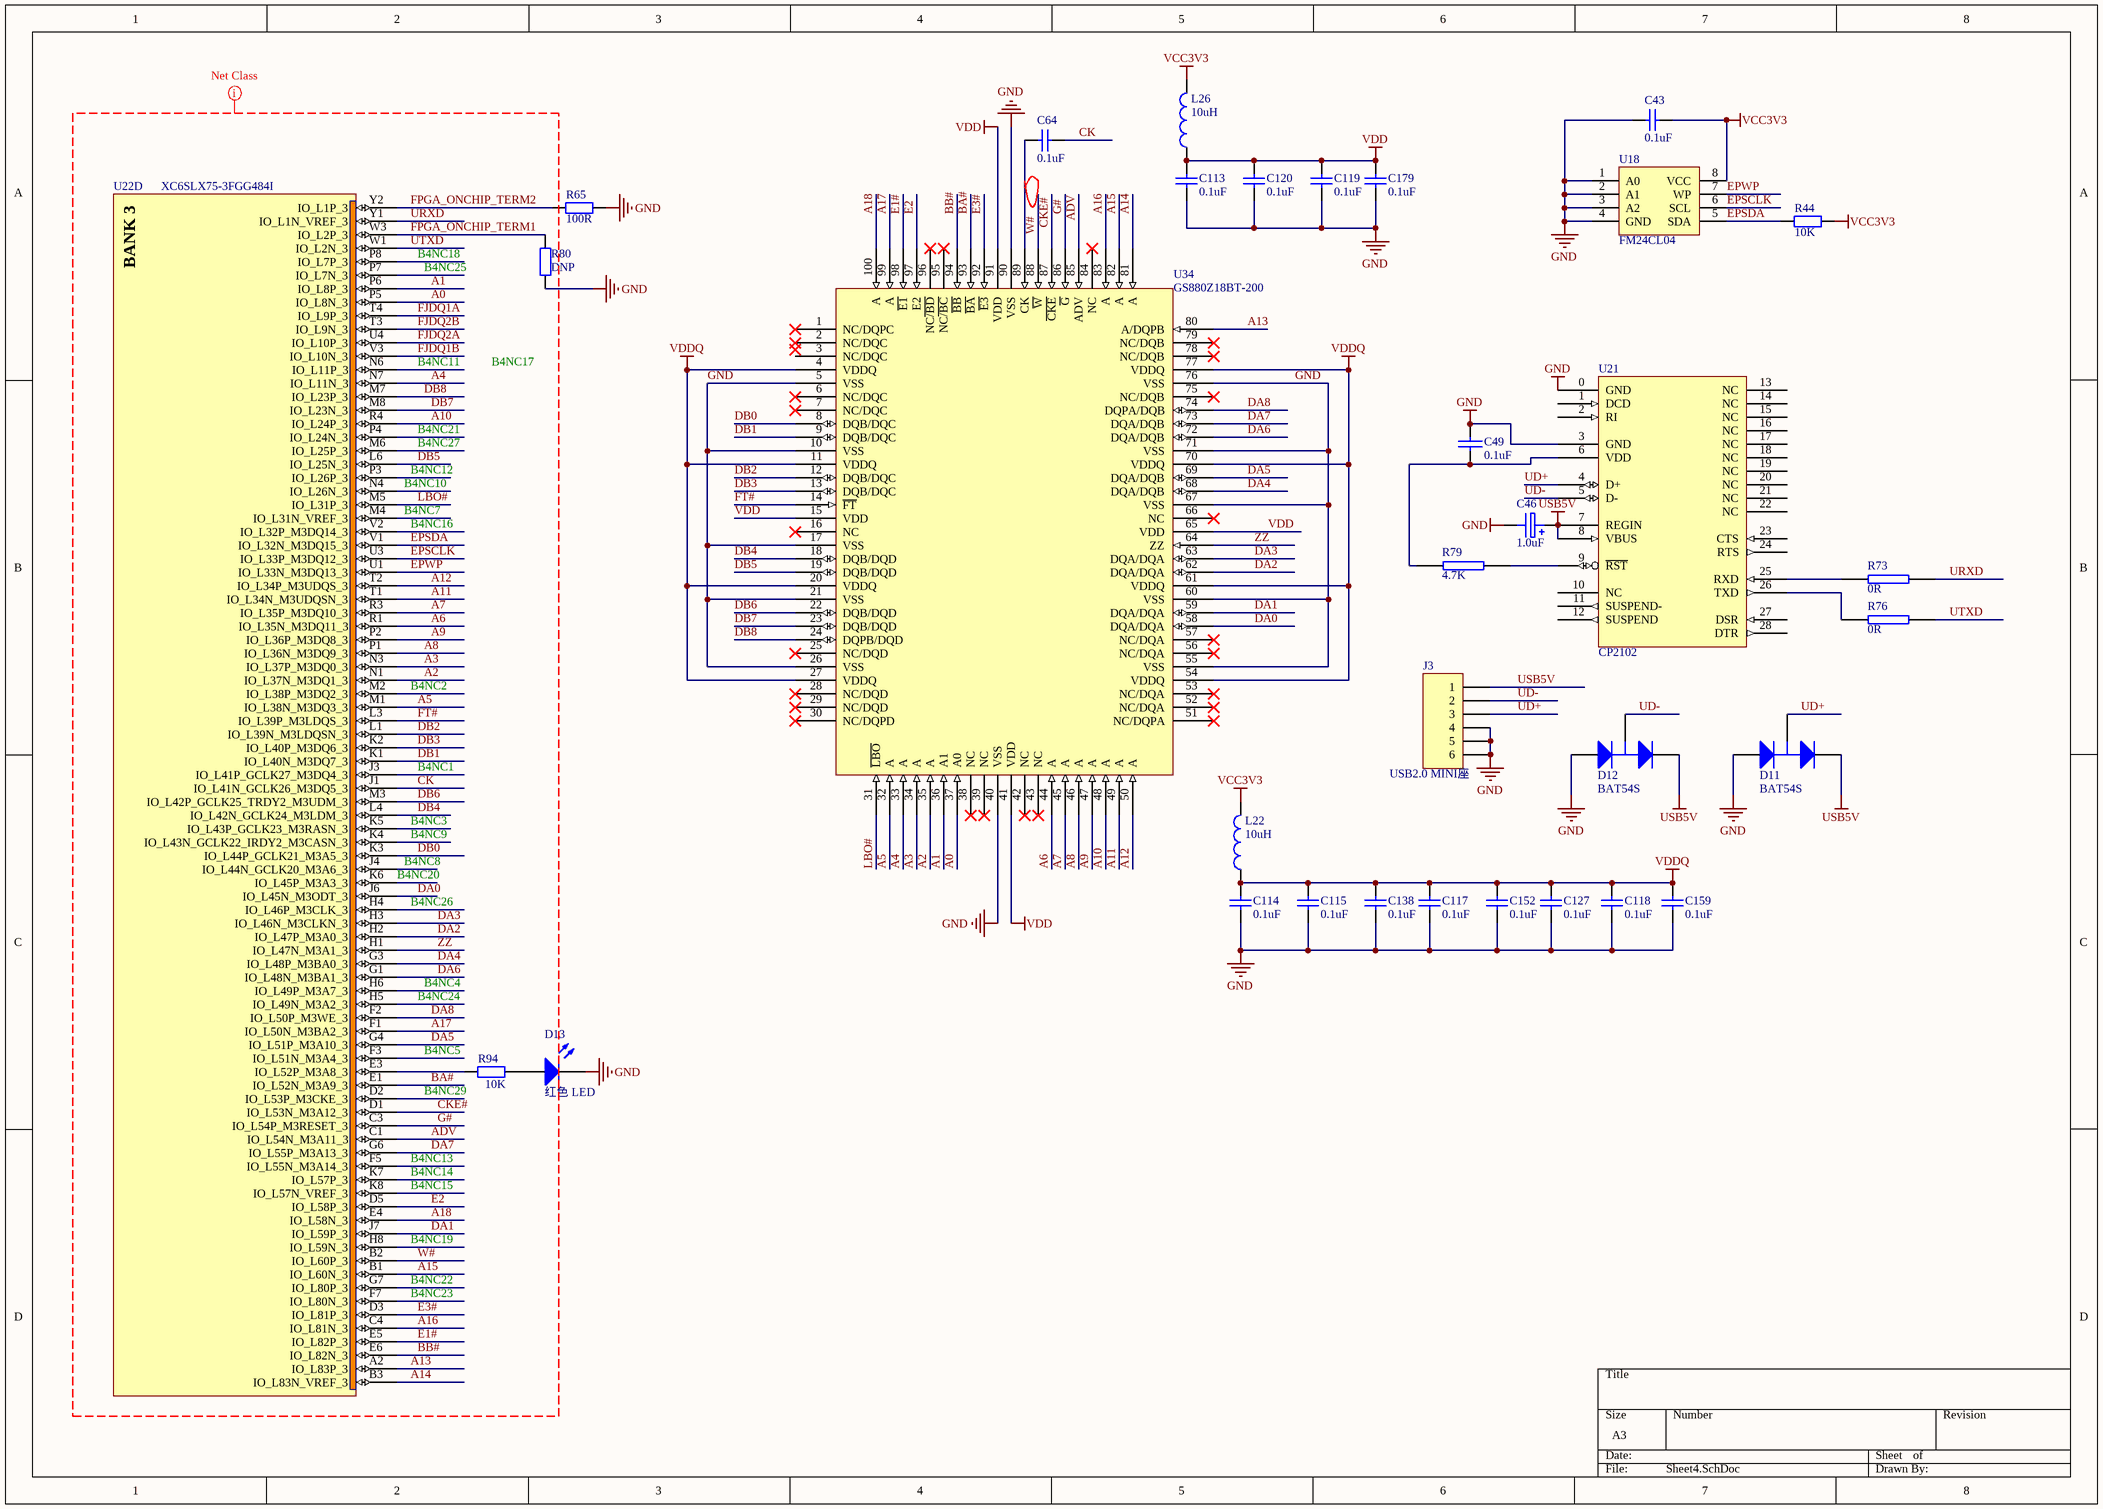
[diagram p2: Sheet4.SchDoc]

### Parts
C43  0.1uF  [0603C]
C46  1.0uF  [0805C]
C49  0.1uF  [0603C]
C64  0.1uF  [0402C]
C113  0.1uF  [0402C]
C114  0.1uF  [0402C]
C115  0.1uF  [0402C]
C117  0.1uF  [0402C]
C118  0.1uF  [0402C]
C119  0.1uF  [0402C]
C120  0.1uF  [0402C]
C127  0.1uF  [0402C]
C138  0.1uF  [0402C]
C152  0.1uF  [0402C]
C159  0.1uF  [0402C]
C179  0.1uF  [0402C]
D11  BAT54S  [SOT23-3L]
D12  BAT54S  [SOT23-3L]
D13  红色 LED  [0805LED]
J3  USB2.0 MINI座  [HDR1X4]
L22  10uH  [1206L]
L26  10uH  [1206L]
R44  10K  [0603R]
R65  100R  [0603R]
R73  0R  [0603R]
R76  0R  [0603R]
R79  4.7K  [0603R]
R80  DNP  [0603R]
R94  10K  [0603R]
U18  FM24CL04  [so_8]
U21  CP2102  [MLP-28]
U22  XC6SLX75-3FGG484I  [FGG484]  (part D of 8)
U34  GS880Z18BT-200  [QFP65P1680X2280-100N]

### Nets
GND: C43.2 C46.2 C49.2 C113.1 C114.1 C115.1 C117.1 C118.1 C119.1 C120.1 C127.1 C138.1 C152.1 C159.1 C179.1 D11.1(A) D12.1(A) D13.2(K) J3.4 J3.5 J3.6 R65.2 R80.2 U18.1(A0) U18.2(A1) U18.3(A2) U18.4(GND) U21.0(GND) U21.3(GND) U34.5(VSS) U34.10(VSS) U34.17(VSS) U34.21(VSS) U34.26(VSS) U34.40(VSS) U34.55(VSS) U34.60(VSS) U34.67(VSS) U34.71(VSS) U34.76(VSS) U34.90(VSS)
USB5V: C46.1 D11.2(K) D12.2(K) J3.1 U21.7(REGIN) U21.8(VBUS)
VCC3V3: C43.1 L22.2 L26.2 R44.2 U18.8(VCC)
VDD: C113.2 C119.2 C120.2 C179.2 L26.1 U34.15(VDD) U34.41(VDD) U34.65(VDD) U34.91(VDD)
VDDQ: C114.2 C115.2 C117.2 C118.2 C127.2 C138.2 C152.2 C159.2 L22.1 U34.4(VDDQ) U34.11(VDDQ) U34.20(VDDQ) U34.27(VDDQ) U34.54(VDDQ) U34.61(VDDQ) U34.70(VDDQ) U34.77(VDDQ)
A0: U22.P5(IO_L8N_3) U34.37(A0)
A1: U22.P6(IO_L8P_3) U34.36(A1)
A2: U22.N1(IO_L37N_M3DQ1_3) U34.35(A)
A3: U22.N3(IO_L37P_M3DQ0_3) U34.34(A)
A4: U22.N7(IO_L11N_3) U34.33(A)
A5: U22.M1(IO_L38N_M3DQ3_3) U34.32(A)
A6: U22.R1(IO_L35N_M3DQ11_3) U34.44(A)
A7: U22.R3(IO_L35P_M3DQ10_3) U34.45(A)
A8: U22.P1(IO_L36N_M3DQ9_3) U34.46(A)
A9: U22.P2(IO_L36P_M3DQ8_3) U34.47(A)
A10: U22.R4(IO_L24P_3) U34.48(A)
A11: U22.T1(IO_L34N_M3UDQSN_3) U34.49(A)
A12: U22.T2(IO_L34P_M3UDQS_3) U34.50(A)
A13: U22.A2(IO_L83P_3) U34.80(A/DQPB)
A14: U22.B3(IO_L83N_VREF_3) U34.81(A)
A15: U22.B1(IO_L60N_3) U34.82(A)
A16: U22.C4(IO_L81N_3) U34.83(A)
A17: U22.F1(IO_L50N_M3BA2_3) U34.99(A)
A18: U22.E4(IO_L58N_3) U34.100(A)
ADV: U22.C1(IO_L54N_M3A11_3) U34.85(ADV)
B4NC1: U22.J3(IO_L41P_GCLK27_M3DQ4_3)
B4NC2: U22.M2(IO_L38P_M3DQ2_3)
B4NC3: U22.K5(IO_L43P_GCLK23_M3RASN_3)
B4NC4: U22.H6(IO_L49P_M3A7_3)
B4NC5: U22.F3(IO_L51N_M3A4_3)
B4NC7: U22.M4(IO_L31N_VREF_3)
B4NC8: U22.J4(IO_L44N_GCLK20_M3A6_3)
B4NC9: U22.K4(IO_L43N_GCLK22_IRDY2_M3CASN_3)
B4NC10: U22.N4(IO_L26N_3)
B4NC11: U22.N6(IO_L11P_3)
B4NC12: U22.P3(IO_L26P_3)
B4NC13: U22.F5(IO_L55N_M3A14_3)
B4NC14: U22.K7(IO_L57P_3)
B4NC15: U22.K8(IO_L57N_VREF_3)
B4NC16: U22.V2(IO_L32P_M3DQ14_3)
B4NC18: U22.P8(IO_L7P_3)
B4NC19: U22.H8(IO_L59N_3)
B4NC20: U22.K6(IO_L45P_M3A3_3)
B4NC21: U22.P4(IO_L24N_3)
B4NC22: U22.G7(IO_L80P_3)
B4NC23: U22.F7(IO_L80N_3)
B4NC24: U22.H5(IO_L49N_M3A2_3)
B4NC25: U22.P7(IO_L7N_3)
B4NC26: U22.H4(IO_L46P_M3CLK_3)
B4NC27: U22.M6(IO_L25P_3)
B4NC29: U22.D2(IO_L53P_M3CKE_3)
BA#: U22.E1(IO_L52N_M3A9_3) U34.93(~{BA})
BB#: U22.E6(IO_L82N_3) U34.94(~{BB})
CK: C64.1 U22.J1(IO_L41N_GCLK26_M3DQ5_3)
CKE#: U22.D1(IO_L53N_M3A12_3) U34.87(~{CKE})
DA0: U22.J6(IO_L45N_M3ODT_3) U34.58(DQA/DQA)
DA1: U22.J7(IO_L59P_3) U34.59(DQA/DQA)
DA2: U22.H2(IO_L47P_M3A0_3) U34.62(DQA/DQA)
DA3: U22.H3(IO_L46N_M3CLKN_3) U34.63(DQA/DQA)
DA4: U22.G3(IO_L48P_M3BA0_3) U34.68(DQA/DQB)
DA5: U22.G4(IO_L51P_M3A10_3) U34.69(DQA/DQB)
DA6: U22.G1(IO_L48N_M3BA1_3) U34.72(DQA/DQB)
DA7: U22.G6(IO_L55P_M3A13_3) U34.73(DQA/DQB)
DA8: U22.F2(IO_L50P_M3WE_3) U34.74(DQPA/DQB)
DB0: U22.K3(IO_L44P_GCLK21_M3A5_3) U34.8(DQB/DQC)
DB1: U22.K1(IO_L40N_M3DQ7_3) U34.9(DQB/DQC)
DB2: U22.L1(IO_L39N_M3LDQSN_3) U34.12(DQB/DQC)
DB3: U22.K2(IO_L40P_M3DQ6_3) U34.13(DQB/DQC)
DB4: U22.L4(IO_L42N_GCLK24_M3LDM_3) U34.18(DQB/DQD)
DB5: U22.L6(IO_L25N_3) U34.19(DQB/DQD)
DB6: U22.M3(IO_L42P_GCLK25_TRDY2_M3UDM_3) U34.22(DQB/DQD)
DB7: U22.M8(IO_L23N_3) U34.23(DQB/DQD)
DB8: U22.M7(IO_L23P_3) U34.24(DQPB/DQD)
E1#: U22.E5(IO_L82P_3) U34.98(~{E1})
E2: U22.D5(IO_L58P_3) U34.97(E2)
E3#: U22.D3(IO_L81P_3) U34.92(~{E3})
EPSCLK: U18.6(SCL) U22.U3(IO_L33P_M3DQ12_3)
EPSDA: R44.1 U18.5(SDA) U22.V1(IO_L32N_M3DQ15_3)
EPWP: U18.7(WP) U22.U1(IO_L33N_M3DQ13_3)
FJDQ1A: U22.T4(IO_L9P_3)
FJDQ1B: U22.V3(IO_L10N_3)
FJDQ2A: U22.U4(IO_L10P_3)
FJDQ2B: U22.T3(IO_L9N_3)
FPGA_ONCHIP_TERM1: R80.1 U22.W3(IO_L2P_3)
FPGA_ONCHIP_TERM2: R65.1 U22.Y2(IO_L1P_3)
FT#: U22.L3(IO_L39P_M3LDQS_3) U34.14(~{FT})
G#: U22.C3(IO_L54P_M3RESET_3) U34.86(~{G})
LBO#: U22.M5(IO_L31P_3) U34.31(~{LBO})
UD+: D11.3(C) J3.3 U21.4(D+)
UD-: D12.3(C) J3.2 U21.5(D-)
URXD: R73.1 U22.Y1(IO_L1N_VREF_3)
UTXD: R76.1 U22.W1(IO_L2N_3)
W#: U22.B2(IO_L60P_3) U34.88(~{W})
ZZ: U22.H1(IO_L47N_M3A1_3) U34.64(ZZ)
NetC49_1: C49.1 R79.2 U21.6(VDD)
NetC64_2: C64.2 U34.89(CK)
NetD13_1: D13.1(A) R94.2
NetR73_2: R73.2 U21.25(RXD)
NetR76_2: R76.2 U21.26(TXD)
NetR79_1: R79.1 U21.9(~{RST})
NetR94_1: R94.1 U22.E3(IO_L52P_M3A8_3)

Not connected (* = marked no-connect by the designer): U21 1(DCD) 2(RI) 10(NC) 11(SUSPEND-) 12(SUSPEND) 13(NC) 14(NC) 15(NC) 16(NC) 17(NC) 18(NC) 19(NC) 20(NC) 21(NC) 22(NC) 23(CTS) 24(RTS) 27(DSR) 28(DTR); U34 1(NC/DQPC)* 2(NC/DQC)* 3(NC/DQC) 6(NC/DQC)* 7(NC/DQC)* 16(NC)* 25(NC/DQD)* 28(NC/DQD)* 29(NC/DQD)* 30(NC/DQPD)* 38(NC)* 39(NC)* 42(NC)* 43(NC)* 51(NC/DQPA)* 52(NC/DQA)* 53(NC/DQA)* 56(NC/DQA)* 57(NC/DQA)* 66(NC)* 75(NC/DQB)* 78(NC/DQB)* 79(NC/DQB)* 84(NC)* 95(NC~{/BC})* 96(NC~{/BD})*

### Layout directives
net class BNAK3: A0, A1, A2, A3, A4, A5, A6, A7, A8, A9, A10, A11, A12, A13, A14, A15, A16, A17, A18, ADV, B4NC1, B4NC2, B4NC3, B4NC4, B4NC5, B4NC7, B4NC8, B4NC9, B4NC10, B4NC11, B4NC12, B4NC13, B4NC14, B4NC15, B4NC16, B4NC17, B4NC18, B4NC19, B4NC20, B4NC21, B4NC22, B4NC23, B4NC24, B4NC25, B4NC26, B4NC27, B4NC29, BA#, BB#, CK, CKE#, DA0, DA1, DA2, DA3, DA4, DA5, DA6, DA7, DA8, DB0, DB1, DB2, DB3, DB4, DB5, DB6, DB7, DB8, E1#, E2, E3#, EPSCLK, EPSDA, EPWP, FJDQ1A, FJDQ1B, FJDQ2A, FJDQ2B, FPGA_ONCHIP_TERM1, FPGA_ONCHIP_TERM2, FT#, G#, LBO#, URXD, UTXD, W#, ZZ

### Notes on the sheet
- Labels drawn without touching a wire or pin: B4NC17
- (in symbol XC6SLX45-L1FGG484I, part D) BANK 3

### Library data of the parts
C43 C64 C113-C115 C117-C120 C127 C138 C152 C159 C179 = Cap: Capacitor; Published: 8-Jun-2000; LatestRevisionDate: 17-Jul-2002; LatestRevisionNote: Re-released for DXP Platform.; Publisher: Altium Limited; Value: 0.1uF
  C43 C64: PackageReference: RAD-0.3
  C113-C115 C117-C120 C127 C138 C152 C159 C179: PackageReference: 0805
C46 = ELECTRO1
C49 = CAP: Capacitor
D11 D12 = BAV99: Silicon Switching Diode Array for High-Speed Switching; Published: 21-Mar-2003; DatasheetDocument: Oct-1999; PackageDocument: Sep-2001; PackageReference: SOT-23; Publisher: Altium Limited; ComponentLink1Description: Manufacturer Link; ComponentLink1URL: http://www.infineon.com/; ComponentLink2Description: Datasheet; ComponentLink2URL: http://www.infineon.com/upload/Document/cmc_upload/documents/080/631/bav99series_1.pdf
D13 = LED0: Typical INFRARED GaAs LED; Published: 8-Jun-2000; LatestRevisionDate: 08-Jul-2005; LatestRevisionNote: Mech Layer 1 removed.; PackageReference: LED-0; Publisher: Altium Limited
J3 = Header 6: Header, 6-Pin; LatestRevisionDate: 17-Jul-2002; LatestRevisionNote: Re-released for DXP Platform.; Publisher: Altium Limited
L22 L26 = Inductor: Code_IEC: 1005; Published: 8-Jun-2000; LatestRevisionDate: 29-May-2009; LatestRevisionNote: IPC-7351 Footprint Added.; PackageReference: 0402-A; Publisher: Altium Limited; PackageDescription: Chip Inductor; Code_JEITA: 0402; Value: 10uH
R44 = Resistor
R65 R80 R94 = Res2: Resistor; Published: 8-Jun-2000; LatestRevisionDate: 17-Jul-2002; LatestRevisionNote: Re-released for DXP Platform.; PackageReference: AXIAL-0.4; Publisher: Altium Limited
  R65: Value: 100R
  R80: Value: DNP
  R94: Value: 10K
R73 R76 R79 = RES2
U21 = RF2906(28): 433MHZ PSK/FM/AM/Data Transceiver
U22 = XC6SLX45-L1FGG484I: as U22 on sheet Sheet1; FirstPublished: 17-Nov-2009; DatasheetVersion: ver1.3, Nov-2009; PackageVersion: ver1.1, Dec-2008; PackageReference: FGG484; Publisher: Altium Limited; PackageDescription: 484-Ball Fine Pitch Ball Grid Array 1.00 mm Pitch (FGG484) - Pb-Free; Code_JEDEC: MS-034-AAJ-1; Code_IPC: BGA100P22X22-484; ComponentLink1Description: Spartan-6 Datasheet; ComponentLink1URL: http://www.xilinx.com/support/documentation/data_sheets/ds160.pdf; ComponentLink2Description: Pinout Specification; ComponentLink2URL: http://www.xilinx.com/support/documentation/user_guides/ug385.pdf; ComponentLink3Description: FGG484 Package Drawing; ComponentLink3URL: http://www.xilinx.com/support/documentation/package_specs/fg484.pdf; ComponentLink4Description: Spartan-6 Documents; ComponentLink4URL: http://www.xilinx.com/support/documentation/spartan-6.htm; ComponentLink5Description: Xilinx.com Home; ComponentLink5URL: http://www.xilinx.com
U34 = GS880Z18BT100

## Sheet Sheet5.SchDoc
size A3
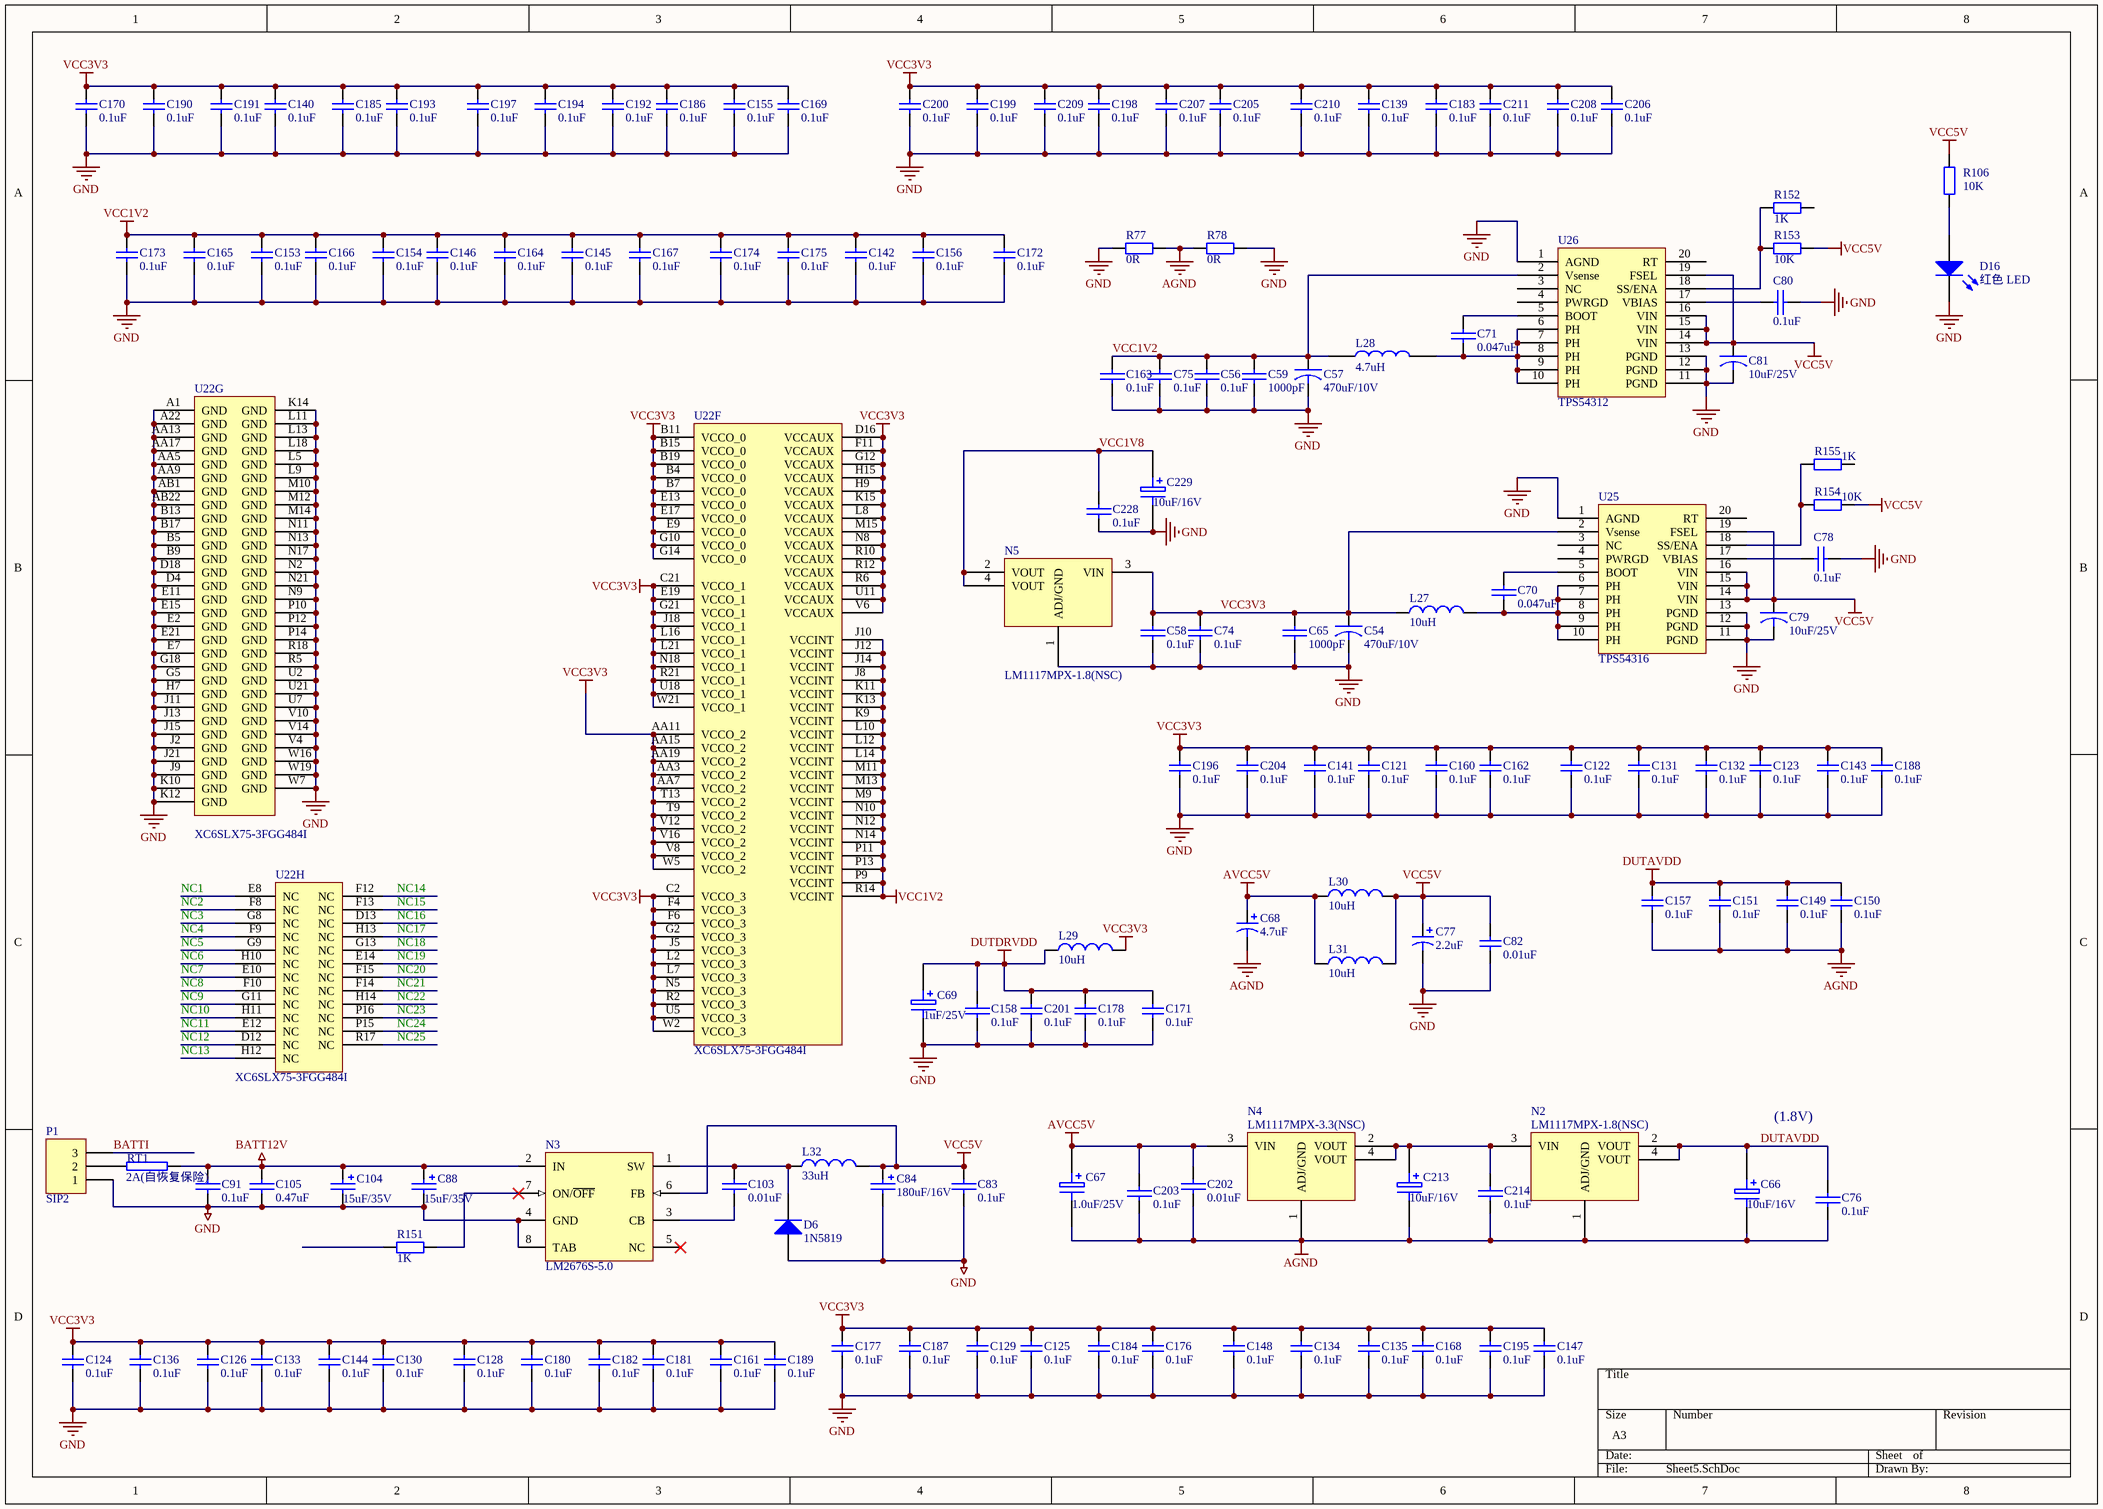
[diagram p3: Sheet5.SchDoc]

### Parts
C54  470uF/10V  [CAP-D]
C56  0.1uF  [0603C]
C57  470uF/10V  [CAP-D]
C58  0.1uF  [0603C]
C59  1000pF  [0603C]
C65  1000pF  [0603C]
C66  10uF/16V  [1210C]
C67  1.0uF/25V  [1210C]
C68  4.7uF  [CAP-B]
C69  1uF/25V  [1206C]
C70  0.047uF  [0603C]
C71  0.047uF  [0603C]
C74  0.1uF  [0603C]
C75  0.1uF  [0603C]
C76  0.1uF  [0603C]
C77  2.2uF  [1210C]
C78  0.1uF  [0603C]
C79  10uF/25V  [CAP-B]
C80  0.1uF  [0603C]
C81  10uF/25V  [CAP-B]
C82  0.01uF  [0603C]
C83  0.1uF  [0805C]
C84  180uF/16V  [CAP-C]
C88  15uF/35V  [CAP-D]
C91  0.1uF  [0805C]
C103  0.01uF  [0603C]
C104  15uF/35V  [CAP-D]
C105  0.47uF  [0805C]
C121  0.1uF  [0402C]
C122  0.1uF  [0402C]
C123  0.1uF  [0402C]
C124  0.1uF  [0402C]
C125  0.1uF  [0402C]
C126  0.1uF  [0402C]
C128  0.1uF  [0402C]
C129  0.1uF  [0402C]
C130  0.1uF  [0402C]
C131  0.1uF  [0402C]
C132  0.1uF  [0402C]
C133  0.1uF  [0402C]
C134  0.1uF  [0402C]
C135  0.1uF  [0402C]
C136  0.1uF  [0402C]
C139  0.1uF  [0402C]
C140  0.1uF  [0402C]
C141  0.1uF  [0402C]
C142  0.1uF  [0402C]
C143  0.1uF  [0402C]
C144  0.1uF  [0402C]
C145  0.1uF  [0402C]
C146  0.1uF  [0402C]
C147  0.1uF  [0402C]
C148  0.1uF  [0402C]
C149  0.1uF  [0402C]
C150  0.1uF  [0402C]
C151  0.1uF  [0402C]
C153  0.1uF  [0402C]
C154  0.1uF  [0402C]
C155  0.1uF  [0402C]
C156  0.1uF  [0402C]
C157  0.1uF  [0402C]
C158  0.1uF  [0402C]
C160  0.1uF  [0402C]
C161  0.1uF  [0402C]
C162  0.1uF  [0402C]
C163  0.1uF  [0402C]
C164  0.1uF  [0402C]
C165  0.1uF  [0402C]
C166  0.1uF  [0402C]
C167  0.1uF  [0402C]
C168  0.1uF  [0402C]
C169  0.1uF  [0402C]
C170  0.1uF  [0402C]
C171  0.1uF  [0402C]
C172  0.1uF  [0402C]
C173  0.1uF  [0402C]
C174  0.1uF  [0402C]
C175  0.1uF  [0402C]
C176  0.1uF  [0402C]
C177  0.1uF  [0402C]
C178  0.1uF  [0402C]
C180  0.1uF  [0402C]
C181  0.1uF  [0402C]
C182  0.1uF  [0402C]
C183  0.1uF  [0402C]
C184  0.1uF  [0402C]
C185  0.1uF  [0402C]
C186  0.1uF  [0402C]
C187  0.1uF  [0402C]
C188  0.1uF  [0402C]
C189  0.1uF  [0402C]
C190  0.1uF  [0402C]
C191  0.1uF  [0402C]
C192  0.1uF  [0402C]
C193  0.1uF  [0402C]
C194  0.1uF  [0402C]
C195  0.1uF  [0402C]
C196  0.1uF  [0402C]
C197  0.1uF  [0402C]
C198  0.1uF  [0402C]
C199  0.1uF  [0402C]
C200  0.1uF  [0402C]
C201  0.1uF  [0402C]
C202  0.01uF  [0603C]
C203  0.1uF  [0603C]
C204  0.1uF  [0402C]
C205  0.1uF  [0402C]
C206  0.1uF  [0402C]
C207  0.1uF  [0402C]
C208  0.1uF  [0402C]
C209  0.1uF  [0402C]
C210  0.1uF  [0402C]
C211  0.1uF  [0402C]
C213  10uF/16V  [1210C]
C214  0.1uF  [0603C]
C228  0.1uF  [0603C]
C229  10uF/16V  [1210C]
D6  1N5819  [L3583A]
D16  红色 LED  [0805LED]
L27  10uH  [L5R2]
L28  4.7uH  [L5R2]
L29  10uH  [1206L]
L30  10uH  [1206L]
L31  10uH  [1206L]
L32  33uH  [L5R2]
N2  LM1117MPX-1.8(NSC)  [SOT-223]
N3  LM2676S-5.0  [TS7B_N]
N4  LM1117MPX-3.3(NSC)  [SOT-223]
N5  LM1117MPX-1.8(NSC)  [SOT-223]
P1  SIP2  [SIP3X]
R77  0R  [1206R]
R78  0R  [1206R]
R106  10K  [0603R]
R151  1K  [0603R]
R152  1K  [0603R]
R153  10K  [0603R]
R154  10K  [0603R]
R155  1K  [0603R]
RT1  2A(自恢复保险)  [1812X]
U22  XC6SLX75-3FGG484I  [FGG484]  (parts F,G,H of 8)
U25  TPS54316  [SOP20]
U26  TPS54312  [SOP20]

### Nets
AGND: C66.2 C67.2 C68.2 C76.2 C149.1 C150.1 C151.1 C157.1 C202.2 C203.2 C213.2 C214.2 N2.1(ADJ/GND) N4.1(ADJ/GND) R77.1 R78.2
AVCC5V: C67.1 C68.1 C202.1 C203.1 L30.1 L31.1 N4.3(VIN)
BATT12V: C88.1 C91.1 C104.1 C105.1 N3.2(IN) RT1.2
DUTAVDD: C66.1 C76.1 C149.2 C150.2 C151.2 C157.2 N2.2(VOUT) N2.4(VOUT)
DUTDRVDD: C69.1 C158.1 C171.2 C178.2 C201.2 L29.1
GND: C54.2 C56.2 C57.2 C58.2 C59.1 C65.1 C69.2 C74.2 C75.2 C77.2 C78.2 C79.2 C80.2 C81.2 C82.2 C83.2 C84.2 C88.2 C91.2 C104.2 C105.2 C121.1 C122.1 C123.1 C124.1 C125.1 C126.1 C128.1 C129.1 C130.1 C131.1 C132.1 C133.1 C134.1 C135.1 C136.1 C139.1 C140.1 C141.1 C142.1 C143.1 C144.1 C145.1 C146.1 C147.1 C148.1 C153.1 C154.1 C155.1 C156.1 C158.2 C160.1 C161.1 C162.1 C163.2 C164.1 C165.1 C166.1 C167.1 C168.1 C169.1 C170.1 C171.1 C172.1 C173.1 C174.1 C175.1 C176.1 C177.1 C178.1 C180.1 C181.1 C182.1 C183.1 C184.1 C185.1 C186.1 C187.1 C188.1 C189.1 C190.1 C191.1 C192.1 C193.1 C194.1 C195.1 C196.1 C197.1 C198.1 C199.1 C200.1 C201.1 C204.1 C205.1 C206.1 C207.1 C208.1 C209.1 C210.1 C211.1 C228.2 C229.2 D6.1(A) D16.2(K) N3.4(GND) N3.8(TAB) N5.1(ADJ/GND) P1.1 R77.2 R78.1 U22.A1(GND) U22.A22(GND) U22.AA5(GND) U22.AA9(GND) U22.AA13(GND) U22.AA17(GND) U22.AB1(GND) U22.AB22(GND) U22.B5(GND) U22.B9(GND) U22.B13(GND) U22.B17(GND) U22.D4(GND) U22.D18(GND) U22.E2(GND) U22.E7(GND) U22.E11(GND) U22.E15(GND) U22.E21(GND) U22.G5(GND) U22.G18(GND) U22.H7(GND) U22.J2(GND) U22.J9(GND) U22.J11(GND) U22.J13(GND) U22.J15(GND) U22.J21(GND) U22.K10(GND) U22.K12(GND) U22.K14(GND) U22.L5(GND) U22.L9(GND) U22.L11(GND) U22.L13(GND) U22.L18(GND) U22.M10(GND) U22.M12(GND) U22.M14(GND) U22.N2(GND) U22.N9(GND) U22.N11(GND) U22.N13(GND) U22.N17(GND) U22.N21(GND) U22.P10(GND) U22.P12(GND) U22.P14(GND) U22.R5(GND) U22.R18(GND) U22.U2(GND) U22.U7(GND) U22.U21(GND) U22.V4(GND) U22.V10(GND) U22.V14(GND) U22.W7(GND) U22.W16(GND) U22.W19(GND) U25.1(AGND) U25.11(PGND) U25.12(PGND) U25.13(PGND) U26.1(AGND) U26.11(PGND) U26.12(PGND) U26.13(PGND)
VCC1V2: C56.1 C57.1 C59.2 C75.1 C142.2 C145.2 C146.2 C153.2 C154.2 C156.2 C163.1 C164.2 C165.2 C166.2 C167.2 C172.2 C173.2 C174.2 C175.2 L28.1 U22.J8(VCCINT) U22.J10(VCCINT) U22.J12(VCCINT) U22.J14(VCCINT) U22.K9(VCCINT) U22.K11(VCCINT) U22.K13(VCCINT) U22.L10(VCCINT) U22.L12(VCCINT) U22.L14(VCCINT) U22.M9(VCCINT) U22.M11(VCCINT) U22.M13(VCCINT) U22.N10(VCCINT) U22.N12(VCCINT) U22.N14(VCCINT) U22.P9(VCCINT) U22.P11(VCCINT) U22.P13(VCCINT) U22.R14(VCCINT) U26.2(Vsense)
VCC1V8: C228.1 C229.1 N5.2(VOUT) N5.4(VOUT)
VCC3V3: C54.1 C58.1 C65.2 C74.1 C121.2 C122.2 C123.2 C124.2 C125.2 C126.2 C128.2 C129.2 C130.2 C131.2 C132.2 C133.2 C134.2 C135.2 C136.2 C139.2 C140.2 C141.2 C143.2 C144.2 C147.2 C148.2 C155.2 C160.2 C161.2 C162.2 C168.2 C169.2 C170.2 C176.2 C177.2 C180.2 C181.2 C182.2 C183.2 C184.2 C185.2 C186.2 C187.2 C188.2 C189.2 C190.2 C191.2 C192.2 C193.2 C194.2 C195.2 C196.2 C197.2 C198.2 C199.2 C200.2 C204.2 C205.2 C206.2 C207.2 C208.2 C209.2 C210.2 C211.2 L27.1 L29.2 N5.3(VIN) U22.AA3(VCCO_2) U22.AA7(VCCO_2) U22.AA11(VCCO_2) U22.AA15(VCCO_2) U22.AA19(VCCO_2) U22.B4(VCCO_0) U22.B7(VCCO_0) U22.B11(VCCO_0) U22.B15(VCCO_0) U22.B19(VCCO_0) U22.C2(VCCO_3) U22.C21(VCCO_1) U22.D16(VCCAUX) U22.E9(VCCO_0) U22.E13(VCCO_0) U22.E17(VCCO_0) U22.E19(VCCO_1) U22.F4(VCCO_3) U22.F6(VCCO_3) U22.F11(VCCAUX) U22.G2(VCCO_3) U22.G10(VCCO_0) U22.G12(VCCAUX) U22.G14(VCCO_0) U22.G21(VCCO_1) U22.H9(VCCAUX) U22.H15(VCCAUX) U22.J5(VCCO_3) U22.J18(VCCO_1) U22.K15(VCCAUX) U22.L2(VCCO_3) U22.L7(VCCO_3) U22.L8(VCCAUX) U22.L16(VCCO_1) U22.L21(VCCO_1) U22.M15(VCCAUX) U22.N5(VCCO_3) U22.N8(VCCAUX) U22.N18(VCCO_1) U22.R2(VCCO_3) U22.R6(VCCAUX) U22.R10(VCCAUX) U22.R12(VCCAUX) U22.R21(VCCO_1) U22.T9(VCCO_2) U22.T13(VCCO_2) U22.U5(VCCO_3) U22.U11(VCCAUX) U22.U18(VCCO_1) U22.V6(VCCAUX) U22.V8(VCCO_2) U22.V12(VCCO_2) U22.V16(VCCO_2) U22.W2(VCCO_3) U22.W5(VCCO_2) U22.W21(VCCO_1) U25.2(Vsense)
VCC5V: C77.1 C79.1 C81.1 C82.1 C83.1 C84.1 L30.2 L31.2 L32.2 N3.6(FB) R106.2 R153.1 R154.1 U25.14(VIN) U25.15(VIN) U25.16(VIN) U25.19(FSEL) U26.14(VIN) U26.15(VIN) U26.16(VIN) U26.19(FSEL)
BATTI: P1.3
NC1: U22.E8(NC)
NC2: U22.F8(NC)
NC3: U22.G8(NC)
NC4: U22.F9(NC)
NC5: U22.G9(NC)
NC6: U22.H10(NC)
NC7: U22.E10(NC)
NC8: U22.F10(NC)
NC9: U22.G11(NC)
NC10: U22.H11(NC)
NC11: U22.E12(NC)
NC12: U22.D12(NC)
NC13: U22.H12(NC)
NC14: U22.F12(NC)
NC15: U22.F13(NC)
NC16: U22.D13(NC)
NC17: U22.H13(NC)
NC18: U22.G13(NC)
NC19: U22.E14(NC)
NC20: U22.F15(NC)
NC21: U22.F14(NC)
NC22: U22.H14(NC)
NC23: U22.P16(NC)
NC24: U22.P15(NC)
NC25: U22.R17(NC)
NetC70_1: C70.1 L27.2 U25.6(PH) U25.7(PH) U25.8(PH) U25.9(PH) U25.10(PH)
NetC70_2: C70.2 U25.5(BOOT)
NetC71_1: C71.1 L28.2 U26.6(PH) U26.7(PH) U26.8(PH) U26.9(PH) U26.10(PH)
NetC71_2: C71.2 U26.5(BOOT)
NetC78_1: C78.1 U25.17(VBIAS)
NetC80_1: C80.1 U26.17(VBIAS)
NetC103_1: C103.1 D6.2(K) L32.1 N3.1(SW)
NetC103_2: C103.2 N3.3(CB)
NetC213_1: C213.1 C214.1 N2.3(VIN) N4.2(VOUT) N4.4(VOUT)
NetD16_1: D16.1(A) R106.1
NetN3_7: N3.7(ON/~{OFF}) R151.1
NetP1_2: P1.2 RT1.1
NetR152_2: R152.2 R153.2 U26.18(SS/ENA)
NetR154_2: R154.2 R155.2 U25.18(SS/ENA)

Not connected (* = marked no-connect by the designer): N3 5(NC)*; R151 2; R152 1; R155 1; U25 3(NC) 4(PWRGD) 20(RT); U26 3(NC) 4(PWRGD) 20(RT)

### Notes on the sheet
- (1.8V)

### Library data of the parts
C54 C57 C79 C81 = CAPACITOR
C56 C58 C59 C65 C70 C71 C74-C76 C78 C80 C83 C91 C103 C105 C158 C163 C202 C203 C214 C228 = CAP: Capacitor
C66 C67 C69 C213 C229 = ELECTRO1: Electrolytic Capacitor
C68 C77 = Cap Pol1: Polarized Capacitor (Radial); Published: 8-Jun-2000; LatestRevisionDate: 17-Jul-2002; LatestRevisionNote: Re-released for DXP Platform.; PackageReference: RB7.6-15; Publisher: Altium Limited
  C68: Value: 4.7uF
  C77: Value: 2.2uF
C82 C121-C126 C128-C136 C139-C151 C153-C157 C160-C162 C164-C178 C180-C201 C204-C211 = Cap: Capacitor; Published: 8-Jun-2000; LatestRevisionDate: 17-Jul-2002; LatestRevisionNote: Re-released for DXP Platform.; Publisher: Altium Limited
  C82: PackageReference: RAD-0.3; Value: 0.01uF
  C121-C126 C128-C136 C139-C151 C153-C157 C160-C162 C164-C178 C180-C201 C204-C211: PackageReference: 0805; Value: 0.1uF
C84 C88 C104 = CAP+
D6 = Diode: Default Diode; Published: 8-Jun-2000; LatestRevisionDate: 17-Jul-2002; LatestRevisionNote: Re-released for DXP Platform.; PackageVersion: Sep-1996; PackageReference: SMC; Publisher: Altium Limited; Code_JEDEC: DO-214-AB
D16 = LED0: Typical INFRARED GaAs LED; Published: 8-Jun-2000; LatestRevisionDate: 08-Jul-2005; LatestRevisionNote: Mech Layer 1 removed.; PackageReference: LED-0; Publisher: Altium Limited
L27 L29-L32 = Inductor: Code_IEC: 1005; Published: 8-Jun-2000; LatestRevisionDate: 29-May-2009; LatestRevisionNote: IPC-7351 Footprint Added.; PackageReference: 0402-A; Publisher: Altium Limited; PackageDescription: Chip Inductor; Code_JEITA: 0402
  L27 L29-L31: Value: 10uH
  L32: Value: 33uH
L28 = INDUCTOR1
N2 N5 = LM1117: LM1117MPX-3.3(NSC)
N3 = LM2676S-5.0: SIMPLE SWITCHER High Efficiency 3A Step-Down Voltage Regulator; Manufacturer: National Semiconductor; PackageTopMarking: NSUZXYTT*LM2676*S-5.0; PowerWise: N; FirstPublished: 4-Dec-2008; DatasheetVersion: Feb-2008; PackageVersion: revE, Jul-2003; PackageReference: TS7B; Publisher: Altium Limited; PackageDescription: TO-263, Molded, .400 x .390 x .180in Body, 7 Lead, .050in Pitch, Surface Mount; CompType: Switcher; PartNumber: LM2676S-5.0; RoHS: O; PinCount: 7; DigiKeyPartNumber: LM2676S-5.0-ND; Code_JEDEC: MO-169-AC; ComponentLink1Description: LM2676 Datasheet; ComponentLink1URL: http://www.national.com/ds/LM/LM2676.pdf; ComponentLink2Description: LM2676 Web Page; ComponentLink2URL: http://www.national.com/pf/LM/LM2676.html; ComponentLink3Description: TS7B Package Page; ComponentLink3URL: http://www.national.com/packaging/folders/ts7b.html
N4 = LM1117
P1 = Header 3: Header, 3-Pin; LatestRevisionDate: 17-Jul-2002; LatestRevisionNote: Re-released for DXP Platform.; Publisher: Altium Limited
R77 R78 R106 R153 R154 = Res2: Resistor; Published: 8-Jun-2000; LatestRevisionDate: 17-Jul-2002; LatestRevisionNote: Re-released for DXP Platform.; PackageReference: AXIAL-0.4; Publisher: Altium Limited
  R77 R78: Value: 0R
  R106 R153 R154: Value: 10K
R151 R152 R155 = Res2: Resistor; Value: 10K; Published: 8-Jun-2000; LatestRevisionDate: 17-Jul-2002; LatestRevisionNote: Re-released for DXP Platform.; PackageReference: AXIAL-0.4; Publisher: Altium Limited
RT1 = RES2
U22 = XC6SLX45-L1FGG484I: as U22 on sheet Sheet1; FirstPublished: 17-Nov-2009; DatasheetVersion: ver1.3, Nov-2009; PackageVersion: ver1.1, Dec-2008; PackageReference: FGG484; Publisher: Altium Limited; PackageDescription: 484-Ball Fine Pitch Ball Grid Array 1.00 mm Pitch (FGG484) - Pb-Free; Code_JEDEC: MS-034-AAJ-1; Code_IPC: BGA100P22X22-484; ComponentLink1Description: Spartan-6 Datasheet; ComponentLink1URL: http://www.xilinx.com/support/documentation/data_sheets/ds160.pdf; ComponentLink2Description: Pinout Specification; ComponentLink2URL: http://www.xilinx.com/support/documentation/user_guides/ug385.pdf; ComponentLink3Description: FGG484 Package Drawing; ComponentLink3URL: http://www.xilinx.com/support/documentation/package_specs/fg484.pdf; ComponentLink4Description: Spartan-6 Documents; ComponentLink4URL: http://www.xilinx.com/support/documentation/spartan-6.htm; ComponentLink5Description: Xilinx.com Home; ComponentLink5URL: http://www.xilinx.com
U25 = TPS54312

## Nets that join several sheets
BATT12V: Sheet1 (P5.39 P5.40), Sheet5 (6 pins)
GND: Sheet1 (47 pins), Sheet3 (23 pins), Sheet4 (41 pins), Sheet5 (177 pins)
VCC1V8: Sheet3 (C227.2 D20.20), Sheet5 (C228.1 C229.1 N5.2 N5.4)
VCC3V3: Sheet1 (13 pins), Sheet3 (32 pins), Sheet4 (5 pins), Sheet5 (124 pins)
VCC5V: Sheet1 (R109.1 R110.1), Sheet5 (21 pins)